# Altium project BEE-1012 PAY-EXP_V100.PrjPcb (part 2 of 4)

## Sheet 08_SAMA7G54-MPU.SchDoc
size 420 x 297 mm; SheetNumber: 13; SheetTotal: 33
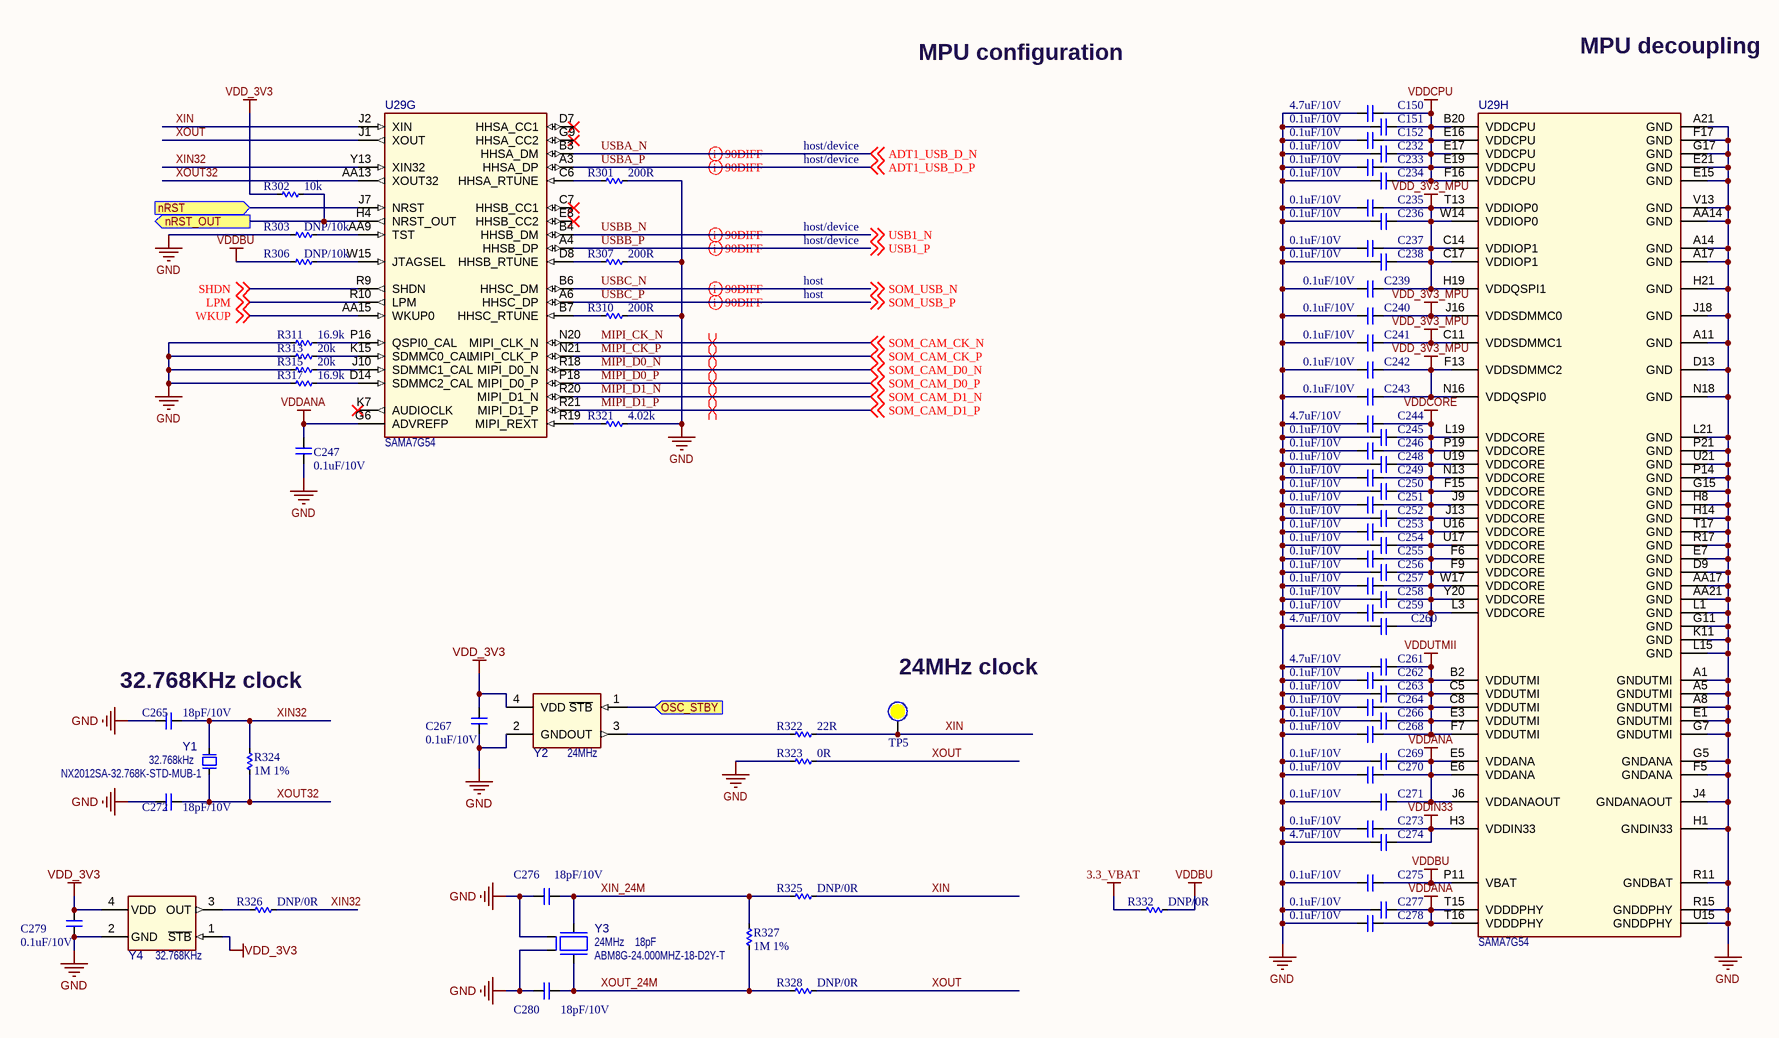
[diagram p14: 08_SAMA7G54-MPU.SchDoc]

### Parts
(Parts that share a designator on the sheet are numbered #1, #2 ... from top to bottom, then left to right.)
C150#2  4.7uF/10V  [CAP_C_1005X50_L]
C151#2  0.1uF/10V  [CAP_C_0603x30]
C152#2  0.1uF/10V  [CAP_C_0603x30]
C232  0.1uF/10V  [CAP_C_0603x30]
C233  0.1uF/10V  [CAP_C_0603x30]
C234  0.1uF/10V  [CAP_C_0603x30]
C235  0.1uF/10V  [CAP_C_0603x30]
C236  0.1uF/10V  [CAP_C_0603x30]
C237  0.1uF/10V  [CAP_C_0603x30]
C238  0.1uF/10V  [CAP_C_0603x30]
C239  0.1uF/10V  [CAP_C_0603x30]
C240  0.1uF/10V  [CAP_C_0603x30]
C241  0.1uF/10V  [CAP_C_0603x30]
C242  0.1uF/10V  [CAP_C_0603x30]
C243  0.1uF/10V  [CAP_C_0603x30]
C244  4.7uF/10V  [CAP_C_1005X50_L]
C245  0.1uF/10V  [CAP_C_0603x30]
C246  0.1uF/10V  [CAP_C_0603x30]
C247  0.1uF/10V  [CAP_C_0603x30]
C248  0.1uF/10V  [CAP_C_0603x30]
C249  0.1uF/10V  [CAP_C_0603x30]
C250  0.1uF/10V  [CAP_C_0603x30]
C251  0.1uF/10V  [CAP_C_0603x30]
C252  0.1uF/10V  [CAP_C_0603x30]
C253  0.1uF/10V  [CAP_C_0603x30]
C254  0.1uF/10V  [CAP_C_0603x30]
C255  0.1uF/10V  [CAP_C_0603x30]
C256  0.1uF/10V  [CAP_C_0603x30]
C257  0.1uF/10V  [CAP_C_0603x30]
C258  0.1uF/10V  [CAP_C_0603x30]
C259  0.1uF/10V  [CAP_C_0603x30]
C260  4.7uF/10V  [CAP_C_1005X50_L]
C261  4.7uF/10V  [CAP_C_1005X50_L]
C262  0.1uF/10V  [CAP_C_0603x30]
C263  0.1uF/10V  [CAP_C_0603x30]
C264  0.1uF/10V  [CAP_C_0603x30]
C265  18pF/10V  [CAP_C_0603x30]
C266  0.1uF/10V  [CAP_C_0603x30]
C267  0.1uF/10V  [CAP_C_0603x30]
C268  0.1uF/10V  [CAP_C_0603x30]
C269  0.1uF/10V  [CAP_C_0603x30]
C270  0.1uF/10V  [CAP_C_0603x30]
C271  0.1uF/10V  [CAP_C_0603x30]
C272  18pF/10V  [CAP_C_0603x30]
C273  0.1uF/10V  [CAP_C_0603x30]
C274  4.7uF/10V  [CAP_C_1005X50_L]
C275  0.1uF/10V  [CAP_C_0603x30]
C276  18pF/10V  [CAP_C_0603x30]
C277  0.1uF/10V  [CAP_C_0603x30]
C278  0.1uF/10V  [CAP_C_0603x30]
C279  0.1uF/10V  [CAP_C_0603x30]
C280  18pF/10V  [CAP_C_0603x30]
R301  200R  [RES_C_0603X30]
R302  10k  [RES_C_0603X30]
R303  DNP/10k  [RES_C_0603X30]
R306  DNP/10k  [RES_C_0603X30]
R307  200R  [RES_C_0603X30]
R310  200R  [RES_C_0603X30]
R311  16.9k  [RES_C_0603X30]
R313  20k  [RES_C_0603X30]
R315  20k  [RES_C_0603X30]
R317  16.9k  [RES_C_0603X30]
R321  4.02k  [RES_C_0603X30]
R322  22R  [RES_C_0603X30]
R323  0R  [RES_C_0603X30]
R324  1M 1%  [RES_C_1005x30_L]
R325  DNP/0R  [RES_C_0603X30]
R326  DNP/0R  [RES_C_0603X30]
R327  1M 1%  [RES_C_1005x30_L]
R328  DNP/0R  [RES_C_0603X30]
R332  DNP/0R  [RES_C_1005x30_L]
TP5  (no value)  [TP_1mm_SMD]  (no BOM)
U29  SAMA7G54  [TFBGA-343_14x14 - 2.5mm]  (parts G,H of 8)
Y1  value 32.768kHz  Manufacturer Part Number 1: NX2012SA-32.768K-STD-MUB-1  [CRYSTAL_NX2012SA]  (hidden comment: Crystal 2 Pins)
Y2  value 24MHz  [DFN-4_2.5x2]  (hidden comment: DSC10xx DFN-4)
Y3  value 24MHz  Load Capacitance: 18pF  Manufacturer Part Number 1: ABM8G-24.000MHZ-18-D2Y-T  [CRYSTAL_ABM8G]  (hidden comment: Crystal 4 Pins)
Y4  value 32.768KHz  [DFN-4_2x1.6]  (hidden comment: DSC60xx DFN-4_LGA-4)

### Ports
nRST (in), nRST_OUT (out), OSC_STBY (in)

### Nets
3.3_VBAT: R332.1
GND: C150#2.2 C151#2.2 C152#2.2 C232.2 C233.2 C234.2 C235.2 C236.2 C237.2 C238.2 C239.2 C240.2 C241.2 C242.2 C243.2 C244.2 C245.2 C246.2 C247.1 C248.2 C249.2 C250.2 C251.2 C252.2 C253.2 C254.2 C255.2 C256.2 C257.2 C258.2 C259.2 C260.2 C261.2 C262.2 C263.2 C264.2 C265.2 C266.2 C267.1 C268.2 C269.2 C270.2 C271.2 C272.2 C273.2 C274.2 C275.2 C276.2 C277.2 C278.2 C279.1 C280.2 R301.1 R303.2 R307.1 R310.1 R311.2 R313.2 R315.2 R317.2 R321.1 R323.1 U29.A1(GNDUTMI) U29.A5(GNDUTMI) U29.A8(GNDUTMI) U29.A11(GND) U29.A14(GND) U29.A17(GND) U29.A21(GND) U29.AA14(GND) U29.AA17(GND) U29.AA21(GND) U29.D9(GND) U29.D13(GND) U29.E1(GNDUTMI) U29.E7(GND) U29.E15(GND) U29.E21(GND) U29.F5(GNDANA) U29.F17(GND) U29.G5(GNDANA) U29.G7(GNDUTMI) U29.G11(GND) U29.G15(GND) U29.G17(GND) U29.H1(GNDIN33) U29.H8(GND) U29.H14(GND) U29.H21(GND) U29.J4(GNDANAOUT) U29.J18(GND) U29.K11(GND) U29.L1(GND) U29.L15(GND) U29.L21(GND) U29.N18(GND) U29.P14(GND) U29.P21(GND) U29.R11(GNDBAT) U29.R15(GNDDPHY) U29.R17(GND) U29.T17(GND) U29.U15(GNDDPHY) U29.U21(GND) U29.V13(GND) Y2.2(GND) Y3.2(GND) Y3.4(GND) Y4.2(GND)
VDD_3V3: C267.2 C279.2 R302.2 Y2.4(VDD) Y4.1(~{STB}) Y4.4(VDD)
VDD_3V3_MPU: C235.1 C236.1 C237.1 C238.1 C239.1 C240.1 C241.1 C242.1 C243.1 U29.C11(VDDSDMMC1) U29.C14(VDDIOP1) U29.C17(VDDIOP1) U29.F13(VDDSDMMC2) U29.H19(VDDQSPI1) U29.J16(VDDSDMMC0) U29.N16(VDDQSPI0) U29.T13(VDDIOP0) U29.W14(VDDIOP0)
VDDANA: C247.2 C269.1 C270.1 C271.1 C277.1 C278.1 U29.E5(VDDANA) U29.E6(VDDANA) U29.G6(ADVREFP) U29.J6(VDDANAOUT) U29.T15(VDDDPHY) U29.T16(VDDDPHY)
VDDBU: C275.1 R306.2 R332.2 U29.P11(VBAT)
VDDCORE: C244.1 C245.1 C246.1 C248.1 C249.1 C250.1 C251.1 C252.1 C253.1 C254.1 C255.1 C256.1 C257.1 C258.1 C259.1 C260.1 U29.F6(VDDCORE) U29.F9(VDDCORE) U29.F15(VDDCORE) U29.J9(VDDCORE) U29.J13(VDDCORE) U29.L3(VDDCORE) U29.L19(VDDCORE) U29.N13(VDDCORE) U29.P19(VDDCORE) U29.U16(VDDCORE) U29.U17(VDDCORE) U29.U19(VDDCORE) U29.W17(VDDCORE) U29.Y20(VDDCORE)
VDDCPU: C150#2.1 C151#2.1 C152#2.1 C232.1 C233.1 C234.1 U29.B20(VDDCPU) U29.E16(VDDCPU) U29.E17(VDDCPU) U29.E19(VDDCPU) U29.F16(VDDCPU)
VDDIN33: C273.1 C274.1 U29.H3(VDDIN33)
VDDUTMII: C261.1 C262.1 C263.1 C264.1 C266.1 C268.1 U29.B2(VDDUTMI) U29.C5(VDDUTMI) U29.C8(VDDUTMI) U29.E3(VDDUTMI) U29.F7(VDDUTMI)
ADT1_USB_D_N: U29.B3(HHSA_DM) ; off-sheet ADT1_USB_D_N  [also labelled USBA_N]  [project net IF_SOM_USB_N]
ADT1_USB_D_P: U29.A3(HHSA_DP) ; off-sheet ADT1_USB_D_P  [also labelled USBA_P]  [project net IF_SOM_USB_P]
LPM: U29.R10(LPM) ; off-sheet LPM
MIPI_CK_N: U29.N20(MIPI_CLK_N) ; off-sheet SOM_CAM_CK_N  [also labelled SOM_CAM_CK_N]
MIPI_CK_P: U29.N21(MIPI_CLK_P) ; off-sheet SOM_CAM_CK_P  [also labelled SOM_CAM_CK_P]
MIPI_D0_N: U29.R18(MIPI_D0_N) ; off-sheet SOM_CAM_D0_N  [also labelled SOM_CAM_D0_N]
MIPI_D0_P: U29.P18(MIPI_D0_P) ; off-sheet SOM_CAM_D0_P  [also labelled SOM_CAM_D0_P]
MIPI_D1_N: U29.R20(MIPI_D1_N) ; off-sheet SOM_CAM_D1_N  [also labelled SOM_CAM_D1_N]
MIPI_D1_P: U29.R21(MIPI_D1_P) ; off-sheet SOM_CAM_D1_P  [also labelled SOM_CAM_D1_P]
SHDN: U29.R9(SHDN) ; off-sheet SHDN
USBB_N: U29.B4(HHSB_DM) ; off-sheet USB1_N  [also labelled USB1_N]
USBB_P: U29.A4(HHSB_DP) ; off-sheet USB1_P  [also labelled USB1_P]
USBC_N: U29.B6(HHSC_DM) ; off-sheet SOM_USB_N  [also labelled SOM_USB_N]
USBC_P: U29.A6(HHSC_DP) ; off-sheet SOM_USB_P  [also labelled SOM_USB_P]
WKUP: U29.AA15(WKUP0) ; off-sheet WKUP
XIN: R322.2 R325.2 TP5.0 U29.J2(XIN)
XIN32: C265.1 R324.1 R326.2 U29.Y13(XIN32) Y1.2(Osc2)
XIN_24M: C276.1 R325.1 R327.2 Y3.3(Osc2)
XOUT: R323.2 R328.2 U29.J1(XOUT)
XOUT32: C272.1 R324.2 U29.AA13(XOUT32) Y1.1(Osc1)
XOUT_24M: C280.1 R327.1 R328.1 Y3.1(Osc1)
NetC300_2: U29.J7(NRST) ; port nRST
NetQ27_3: Y2.1(~{STB}) ; port OSC_STBY
NetR301_2: R301.2 U29.C6(HHSA_RTUNE)
NetR302_1: R302.1 U29.H4(NRST_OUT) ; port nRST_OUT
NetR303_1: R303.1 U29.AA9(TST)
NetR306_1: R306.1 U29.W15(JTAGSEL)
NetR307_2: R307.2 U29.D8(HHSB_RTUNE)
NetR310_2: R310.2 U29.B7(HHSC_RTUNE)
NetR311_1: R311.1 U29.P16(QSPI0_CAL)
NetR313_1: R313.1 U29.K15(SDMMC0_CAL)
NetR315_1: R315.1 U29.J10(SDMMC1_CAL)
NetR317_1: R317.1 U29.D14(SDMMC2_CAL)
NetR321_2: R321.2 U29.R19(MIPI_REXT)
NetR322_1: R322.1 Y2.3(OUT)
NetR326_1: R326.1 Y4.3(OUT)

Not connected (* = marked no-connect by the designer): U29 C7(HHSB_CC1)* D7(HHSA_CC1)* E8(HHSB_CC2)* G9(HHSA_CC2)* K7(AUDIOCLK)*

### Layout directives
differential pair; differential pair class DIFF90; net class DIFF90: IF_SOM_USB_N, IF_SOM_USB_P, USBB_N, USBB_P, USBC_N, USBC_P
differential pair; net class DIFF100; differential pair class DIFF100: MIPI_CK_N, MIPI_CK_P, MIPI_D0_N, MIPI_D0_P, MIPI_D1_N, MIPI_D1_P

### Notes on the sheet
- MPU configuration
- MPU decoupling
- host/device
- host
- (near C265) 32.768KHz clock
- (near TP5) 24MHz clock
- Project:
- BEE-1012
- Sub-system:
- SATELLITE_EXP_CONTROLLER
- Design by:
- SANG HUYNH
- BAO BUI
- Sheet title:
- Sheet
- A3
- of
- Checked by:
- Approved by:
- VU PHAM
- Revision:
- Document No:
- Size:
- Date:

### Library data of the parts
C150#2 C151#2 C152#2 C232-C280 = _CAP_C_2: CAP
R301-R303 R306 R307 R310 R311 R313 R315 R317 R321-R328 R332 = _RES_B_2: RES
TP5 = Test Point: Solder: NF
U29 = SAMA7G54: SAMA7G54 MPU 1000MHz Cortex-A7 TFBGA-343; Manufacturer Part Number 1: SAMA7G54-V/4HB; Manufacturer 1: Microchip; Description_: MCHP MPU 32-BIT Cortex-A7 1000MHz 128kB SAMA7G54-V/4HB TFBGA-343; Populated: YES; MCHP-ID: MIC8923; Symbol: SAMA7G54 TFBGA-343; Dev Tools Status: Design; Owner: Ciprian Abramov; Package: TFBGA-343; Value: SAMA7G54; Type: 32-Bit MPU; Status: MCL Design; Revision: 1; Category: MCHP-Microcontroller; ComponentLink1Description: SVN Datasheet; ComponentLink2Description: Local Datasheet; ComponentLink3URL: C:\ALTIUM_WORK\00001_MCHP-CDB\Library\LibraryRefs\SAMA7G54 TFBGA-343.SchLib; ComponentLink3Description: Open Symbol; ComponentLink4URL: C:\ALTIUM_WORK\00001_MCHP-CDB\Library\Footprints\TFBGA-343_14x14.PcbLib; ComponentLink4Description: Open Footprint; ComponentLink5Description: Open Footprint 2; ComponentLink6Description: Open Footprint 3; ComponentLink7Description: Open Footprint 4; Supplier 1: Microchip; Supplier Part Number 1: SAMA7G54-V/4HB; Quantity Override: 1
Y1 = OSC_32.768kHz: Crystal; Manufacturer 1: NDK; MCHP-ID: OSC1092; Description_: CRYSTAL 32.768kHz 12.5pF SMD NX2012SA; Dev Tools Status: Production; Owner: Jamus Griego; Tolerance: ±20ppm; Load Capacitance: 12.5pF; Populated: YES; Revision: 1; Symbol: Crystal 2 Pins; Status: MCL Design; ComponentLink1URL: https://chn-vm-apps.microchip.com/mchprepo/parts/Datasheets/c_NX2012SA-STD-MUB-1_e.pdf; ComponentLink1Description: SVN Datasheet; ComponentLink2URL: C:\ALTIUM_WORK\00001_MCHP-CDB\Datasheets\c_NX2012SA-STD-MUB-1_e.pdf; ComponentLink2Description: Local Datasheet; ComponentLink3URL: C:\ALTIUM_WORK\00001_MCHP-CDB\Library\LibraryRefs\Crystal 2 Pins.SchLib; ComponentLink3Description: Open Symbol; ComponentLink4URL: C:\ALTIUM_WORK\00001_MCHP-CDB\Library\Footprints\CRYSTAL_NX2012SA.PcbLib; ComponentLink4Description: Open Footprint; ComponentLink5Description: Open Footprint 2; ComponentLink6Description: Open Footprint 3; ComponentLink7Description: Open Footprint 4; Type: Crystal; Category: Crystal/Oscillator; Supplier 1: Digi-Key; Supplier Part Number 1: 644-1219-1-ND; Quantity Override: 1
Y2 = MIC6659: Manufacturer 1: Microchip Technology; Manufacturer Part Number 1: DSC1001DI5-024.0000T; Description_: MCHP CLOCK OSCILLATOR SINGLE 24MHz DSC1001DI5-024.0000 SMD-2520; Dev Tools Status: Design; Owner: Maurizio Gavardoni; Populated: YES; MCHP-ID: MIC6659; Revision: A; Symbol: DSC10xx DFN-4; Status: MCL Design; ComponentLink1Description: SVN Datasheet; ComponentLink2Description: Local Datasheet; ComponentLink3URL: C:\ALTIUM_WORK\00001_MCHP-CDB\Library\LibraryRefs\DSC10xx DFN-4.SchLib; ComponentLink3Description: Open Symbol; ComponentLink4URL: C:\ALTIUM_WORK\00001_MCHP-CDB\Library\Footprints\DFN-4_2.5x2.PcbLib; ComponentLink4Description: Open Footprint; ComponentLink5Description: Open Footprint 2; ComponentLink6Description: Open Footprint 3; ComponentLink7Description: Open Footprint 4; Category: MCHP-Clock/Timing; Type: Oscillator; Supplier 1: Digi-Key; Supplier Part Number 1: DSC1001DI5-024.0000T-ND; Quantity Override: 1
Y3 = OSC_24MHz: Crystal; Manufacturer 1: Abracon Corporation; MCHP-ID: OSC1047; Description_: CRYSTAL 24MHz 18pF SMD ABM8G; Dev Tools Status: Production; Owner: Mark Loper; Populated: DNP; Revision: 1; Symbol: Crystal 4 Pins; Status: MCL Design; ComponentLink1URL: https://chn-vm-apps.microchip.com/mchprepo/parts/Datasheets/ABM8G.pdf; ComponentLink1Description: SVN Datasheet; ComponentLink2URL: C:\ALTIUM_WORK\00001_MCHP-CDB\Datasheets\ABM8G.pdf; ComponentLink2Description: Local Datasheet; ComponentLink3URL: C:\ALTIUM_WORK\00001_MCHP-CDB\Library\LibraryRefs\Crystal 4 Pins.SchLib; ComponentLink3Description: Open Symbol; ComponentLink4URL: C:\ALTIUM_WORK\00001_MCHP-CDB\Library\Footprints\CRYSTAL_ABM8G.PcbLib; ComponentLink4Description: Open Footprint; ComponentLink5Description: Open Footprint 2; ComponentLink6Description: Open Footprint 3; ComponentLink7Description: Open Footprint 4; Package: ABM8G; Type: Crystal; Category: Crystal/Oscillator; Supplier 1: Digi-Key; Supplier Part Number 1: 535-10273-1-ND; Quantity Override: 1
Y4 = MIC8888: Manufacturer 1: Microchip Technology; Manufacturer Part Number 1: DSC6003MA3B-032K768; Description_: MCHP CLOCK OSCILLATOR SINGLE 32.768KHz DSC6003MA3B-032K768 SMD DFN-4; Dev Tools Status: Design; Owner: Ciprian Abramov; Populated: DNP; MCHP-ID: MIC8888; Revision: 1; Symbol: DSC60xx DFN-4_LGA-4; Status: MCL Design; ComponentLink1Description: SVN Datasheet; ComponentLink2Description: Local Datasheet; ComponentLink3URL: C:\ALTIUM_WORK\00001_MCHP-CDB\Library\LibraryRefs\DSC60xx DFN-4_LGA-4.SchLib; ComponentLink3Description: Open Symbol; ComponentLink4URL: C:\ALTIUM_WORK\00001_MCHP-CDB\Library\Footprints\DFN-4_2x1.6.PcbLib; ComponentLink4Description: Open Footprint; ComponentLink5Description: Open Footprint 2; ComponentLink6Description: Open Footprint 3; ComponentLink7Description: Open Footprint 4; Category: MCHP-Clock/Timing; Type: Oscillator; Supplier 1: Digi-Key; Supplier Part Number 1: DSC6003MA3B-032K768-ND; Quantity Override: 1; Supplier 2: Mouser; Supplier Part Number 2: 579-6003MA3B032K768

## Sheet 08_SAMA7G54-PMIC.SchDoc
size 420 x 297 mm; SheetNumber: 14; SheetTotal: 33
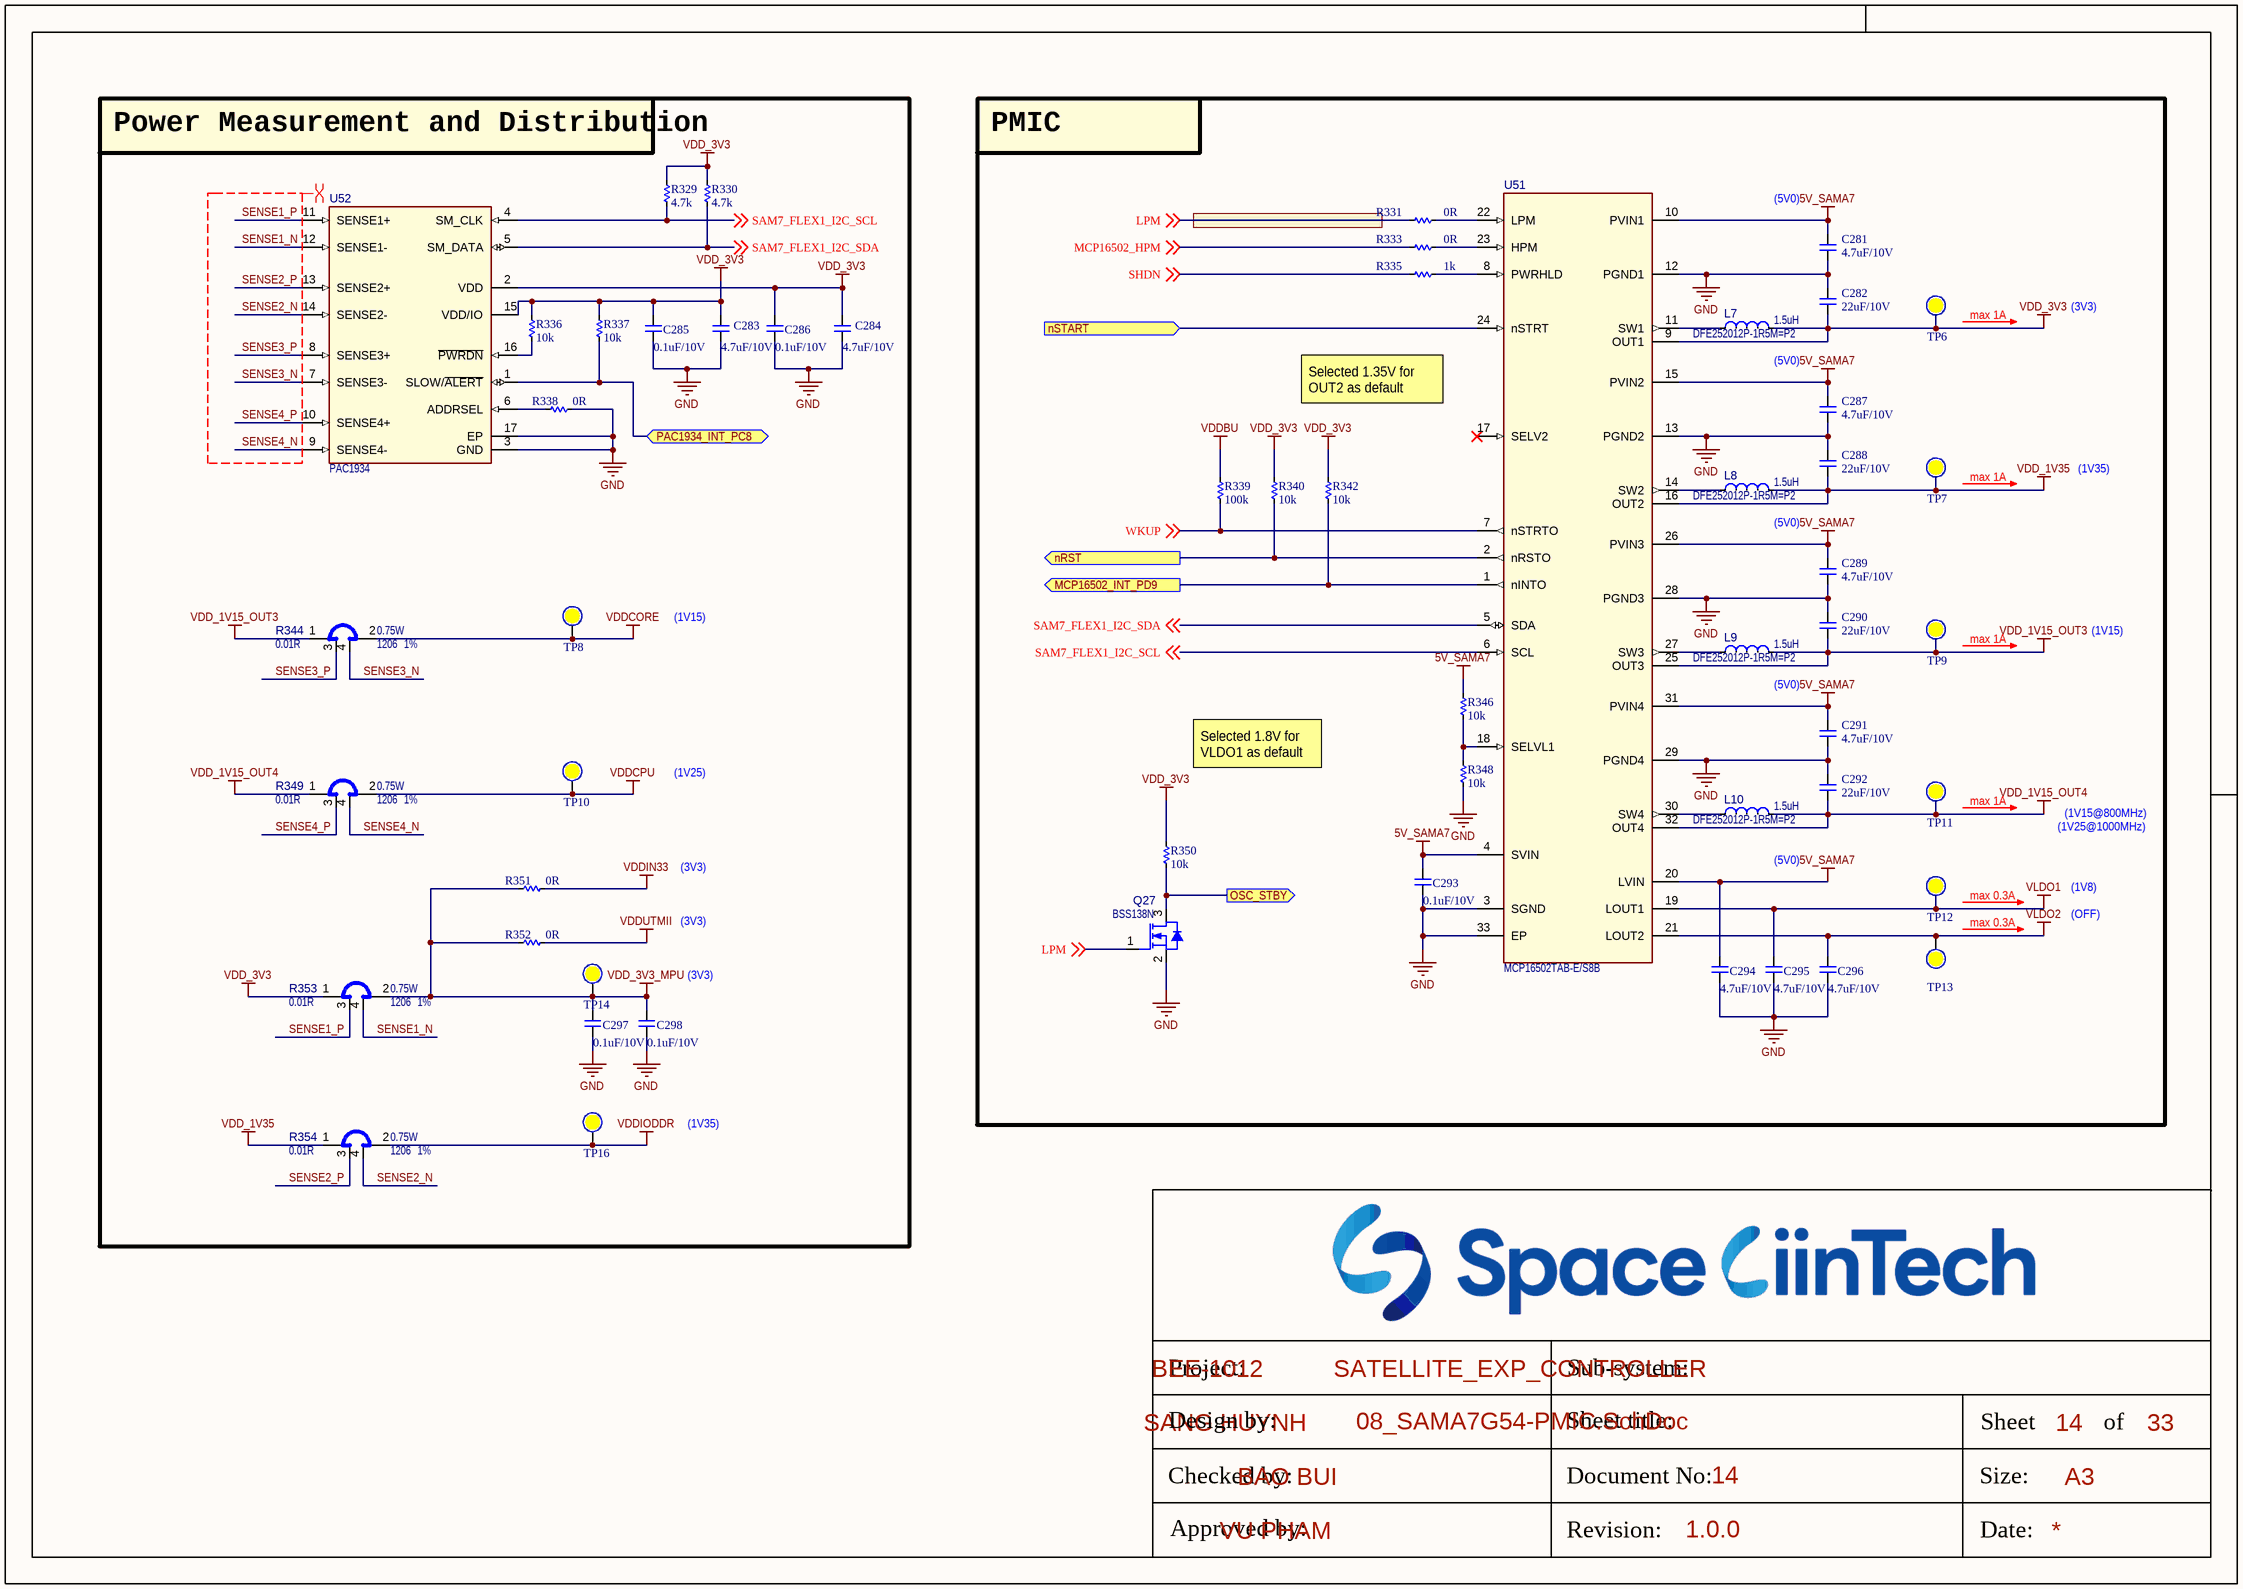
[diagram p15: 08_SAMA7G54-PMIC.SchDoc]

### Parts
C281  4.7uF/10V  [CAP_C_1005X50_L]
C282  22uF/10V  [CAP_C_1608X80]
C283  4.7uF/10V  [CAP_C_1005X50_L]
C284  4.7uF/10V  [CAP_C_1005X50_L]
C285  0.1uF/10V  [CAP_C_1005X50_L]
C286  0.1uF/10V  [CAP_C_0603x30]
C287  4.7uF/10V  [CAP_C_1005X50_L]
C288  22uF/10V  [CAP_C_1608X80]
C289  4.7uF/10V  [CAP_C_1005X50_L]
C290  22uF/10V  [CAP_C_1608X80]
C291  4.7uF/10V  [CAP_C_1005X50_L]
C292  22uF/10V  [CAP_C_1608X80]
C293  0.1uF/10V  [CAP_C_0603x30]
C294  4.7uF/10V  [CAP_C_1005X50_L]
C295  4.7uF/10V  [CAP_C_1005X50_L]
C296  4.7uF/10V  [CAP_C_1005X50_L]
C297  0.1uF/10V  [CAP_C_0603x30]
C298  0.1uF/10V  [CAP_C_0603x30]
L7  value 1.5uH  [IND_C_1008]  (hidden comment: DFE252012P-1R5M=P2)
L8  value 1.5uH  [IND_C_1008]  (hidden comment: DFE252012P-1R5M=P2)
L9  value 1.5uH  [IND_C_1008]  (hidden comment: DFE252012P-1R5M=P2)
L10  value 1.5uH  [IND_C_1008]  (hidden comment: DFE252012P-1R5M=P2)
Q27  value BSS138N  [SOT-23-3]  (hidden comment: BSS138NH6327XTSA2)
R329  4.7k  [RES_C_1005x30_L]
R330  4.7k  [RES_C_1005x30_L]
R331  0R  [RES_C_0603X30]
R333  0R  [RES_C_0603X30]
R335  1k  [RES_C_0603X30]
R336  10k  [RES_C_1005x30_L]
R337  10k  [RES_C_1005x30_L]
R338  0R  [RES_C_0603X30]
R339  100k  [RES_C_0603X30]
R340  10k  [RES_C_0603X30]
R342  10k  [RES_C_0603X30]
R344  value 0.01R  Package: 1206  Tolerance: 1%  Power: 0.75W  [RES_C_1206_SHUNT]  (hidden comment: KRL1632E-M-R010-F-T5)
R346  10k  [RES_C_0603X30]
R348  10k  [RES_C_0603X30]
R349  value 0.01R  Package: 1206  Tolerance: 1%  Power: 0.75W  [RES_C_1206_SHUNT]  (hidden comment: KRL1632E-M-R010-F-T5)
R350  10k  [RES_C_0603X30]
R351  0R  [RES_C_1608X60_L]
R352  0R  [RES_C_1608X60_L]
R353  value 0.01R  Package: 1206  Tolerance: 1%  Power: 0.75W  [RES_C_1206_SHUNT]  (hidden comment: KRL1632E-M-R010-F-T5)
R354  value 0.01R  Package: 1206  Tolerance: 1%  Power: 0.75W  [RES_C_1206_SHUNT]  (hidden comment: KRL1632E-M-R010-F-T5)
TP6  (no value)  [Testpoint_50]  (no BOM)
TP7  (no value)  [Testpoint_50]  (no BOM)
TP8  (no value)  [Testpoint_50]  (no BOM)
TP9  (no value)  [Testpoint_50]  (no BOM)
TP10  (no value)  [Testpoint_50]  (no BOM)
TP11  (no value)  [Testpoint_50]  (no BOM)
TP12  (no value)  [Testpoint_50]  (no BOM)
TP13  (no value)  [Testpoint_50]  (no BOM)
TP14  (no value)  [Testpoint_50]  (no BOM)
TP16  (no value)  [Testpoint_50]  (no BOM)
U51  value MCP16502TAB-E/S8B  [QFN-32_5X5_EP3.7X3.7]  (hidden comment: MCP16502 QFN-32)
U52  value PAC1934  [UQFN-16_4X4_EP2.6X2.6]  (hidden comment: PAC1934 UQFN-16)

### Blocks framed on the sheet
Power Measurement and Distribution: C283-C286 C297 C298 R329 R330 R336-R338 R344 R349 R351-R354 TP8 TP10 TP14 TP16 U52
PMIC: C281 C282 C287-C296 L7-L10 Q27 R331 R333 R335 R339 R340 R342 R346 R348 R350 TP6 TP7 TP9 TP11-TP13 U51

### Ports
MCP16502_INT_PD9 (out), nRST (out), nSTART (in), OSC_STBY (out), PAC1934_INT_PC8 (bidir)

### Nets
5V_SAMA7: C281.1 C287.1 C289.1 C291.1 C293.1 C294.1 R346.1 U51.4(SVIN) U51.10(PVIN1) U51.15(PVIN2) U51.20(LVIN) U51.26(PVIN3) U51.31(PVIN4)
GND: C281.2 C282.1 C283.2 C284.2 C285.2 C286.2 C287.2 C288.1 C289.2 C290.1 C291.2 C292.1 C293.2 C294.2 C295.2 C296.2 C297.2 C298.2 Q27.2(S) R338.2 R348.2 U51.3(SGND) U51.12(PGND1) U51.13(PGND2) U51.28(PGND3) U51.29(PGND4) U51.33(EP) U52.3(GND) U52.17(EP)
VDD_1V15_OUT3: C290.2 L9.2(F) R344.1 TP9.0 U51.25(OUT3)
VDD_1V15_OUT4: C292.2 L10.2(F) R349.1 TP11.0 U51.32(OUT4)
VDD_1V35: C288.2 L8.2(F) R354.1 TP7.0 U51.16(OUT2)
VDD_3V3: C282.2 C283.1 C284.1 C285.1 C286.1 L7.2(F) R329.1 R330.1 R336.1 R337.1 R340.2 R342.2 R350.1 R353.1 TP6.0 U51.9(OUT1) U52.2(VDD) U52.15(VDD/IO)
VDD_3V3_MPU: C297.1 C298.1 R351.1 R352.1 R353.2 TP14.0
VDDBU: R339.2
VDDCORE: R344.2 TP8.0
VDDCPU: R349.2 TP10.0
VDDIN33: R351.2
VDDIODDR: R354.2 TP16.0
VDDUTMII: R352.2
VLDO1: C295.1 TP12.0 U51.19(LOUT1)
VLDO2: C296.1 TP13.0 U51.21(LOUT2)
LPM: Q27.1(G) R331.1 ; off-sheet LPM
MCP16502_HPM: R333.1 ; off-sheet MCP16502_HPM
SAM7_FLEX1_I2C_SCL: R329.2 U51.6(SCL) U52.4(SM_CLK) ; off-sheet SAM7_FLEX1_I2C_SCL
SAM7_FLEX1_I2C_SDA: R330.2 U51.5(SDA) U52.5(SM_DATA) ; off-sheet SAM7_FLEX1_I2C_SDA
SENSE1_N: R353.4 U52.12(SENSE1-)
SENSE1_P: R353.3 U52.11(SENSE1+)
SENSE2_N: R354.4 U52.14(SENSE2-)
SENSE2_P: R354.3 U52.13(SENSE2+)
SENSE3_N: R344.4 U52.7(SENSE3-)
SENSE3_P: R344.3 U52.8(SENSE3+)
SENSE4_N: R349.4 U52.9(SENSE4-)
SENSE4_P: R349.3 U52.10(SENSE4+)
SHDN: R335.1 ; off-sheet SHDN
WKUP: R339.1 U51.7(nSTRTO) ; off-sheet WKUP
NetC300_2: R340.1 U51.2(nRSTO) ; port nRST
NetL7_1: L7.1(S) U51.11(SW1)
NetL8_1: L8.1(S) U51.14(SW2)
NetL9_1: L9.1(S) U51.27(SW3)
NetL10_1: L10.1(S) U51.30(SW4)
NetQ27_3: Q27.3(D) R350.2 ; port OSC_STBY
NetR286_2: U51.24(nSTRT) ; port nSTART
NetR331_2: R331.2 U51.22(LPM)
NetR333_2: R333.2 U51.23(HPM)
NetR335_2: R335.2 U51.8(PWRHLD)
NetR336_2: R336.2 U52.16(~{PWRDN})
NetR337_2: R337.2 U52.1(SLOW/~{ALERT}) ; port PAC1934_INT_PC8
NetR338_1: R338.1 U52.6(ADDRSEL)
NetR342_1: R342.1 U51.1(nINTO) ; port MCP16502_INT_PD9
NetR346_2: R346.2 R348.1 U51.18(SELVL1)

Not connected (* = marked no-connect by the designer): U51 17(SELV2)*

### Layout directives
differential pair: SENSE1_N, SENSE1_P, SENSE2_N, SENSE2_P, SENSE3_N, SENSE3_P, SENSE4_N, SENSE4_P

### Notes on the sheet
- (near C281) (5V0)
- (near TP6) max 1A
- (3V3)
- Selected 1.35V for OUT2 as default
- (5V0)
- (near TP7) max 1A
- (1V35)
- (1V15)
- (near TP9) max 1A
- (1V25)
- Selected 1.8V for VLDO1 as default
- (near TP11) max 1A
- (near L10) (5V0)
- (1V25@1000MHz)
- (1V15@800MHz)
- (near TP12) max 0.3A
- max 0.3A
- (1V8)
- (OFF)
- Project:
- BEE-1012
- Sub-system:
- SATELLITE_EXP_CONTROLLER
- Design by:
- SANG HUYNH
- BAO BUI
- Sheet title:
- Sheet
- A3
- of
- Checked by:
- Approved by:
- VU PHAM
- Revision:
- Document No:
- Size:
- Date:

### Library data of the parts
C281-C298 = _CAP_C_2: CAP
L7-L10 = IND1335: Inductor; Manufacturer 1: Murata Electronics North America; Description_: INDUCTOR 1.5uH 3.5A 20% SMD 1008; Dev Tools Status: Design; Owner: Razvan Cristescu; DCR: 0.06R; RMS Current: 3.5A; Test Frequency: 1MHz; Populated: YES; MCHP-ID: IND1335; Revision: A; Symbol: Inductor; Status: MCL Design; ComponentLink1URL: https://chn-vm-apps.microchip.com/mchprepo/parts/Datasheets/m_dfe252012p.pdf; ComponentLink1Description: SVN Datasheet; ComponentLink2URL: C:\ALTIUM_WORK\00001_MCHP-CDB\Datasheets\m_dfe252012p.pdf; ComponentLink2Description: Local Datasheet; ComponentLink3URL: C:\ALTIUM_WORK\00001_MCHP-CDB\Library\LibraryRefs\Inductor.SchLib; ComponentLink3Description: Open Symbol; ComponentLink4URL: C:\ALTIUM_WORK\00001_MCHP-CDB\Library\Footprints\IND_C_1008.PcbLib; ComponentLink4Description: Open Footprint; ComponentLink5Description: Open Footprint 2; ComponentLink6Description: Open Footprint 3; ComponentLink7Description: Open Footprint 4; Package: 1008; Type: Inductor; Category: Inductor; Manufacturer Part Number 1: DFE252012P-1R5M=P2; Supplier 1: Digi-Key; Supplier Part Number 1: 490-10648-6-ND; Quantity Override: 1
Q27 = TRA1223: Transistor MOS; Manufacturer 1: Infineon Technologies; Description_: TRANS FET N-CH BSS138N 60V 230mA SOT23-3; Dev Tools Status: Production; Type: FET; Current: 230mA; Drain to Source Voltage: 60V; Gate to Source Voltage: 20V; Power: 0.36W; Owner: Dragos Danaila; Populated: YES; MCHP-ID: TRA1223; Revision: 1; Symbol: Transistor MOS-N GSD; Status: MCL Design; Package: SOT23-3; ComponentLink1URL: https://chn-vm-apps.microchip.com/mchprepo/parts/Datasheets/Infineon-BSS138N-DS-v02_86-en.pdf; ComponentLink1Description: SVN Datasheet; ComponentLink2URL: C:\ALTIUM_WORK\00001_MCHP-CDB\Datasheets\Infineon-BSS138N-DS-v02_86-en.pdf; ComponentLink2Description: Local Datasheet; ComponentLink3URL: C:\ALTIUM_WORK\00001_MCHP-CDB\Library\LibraryRefs\Transistor MOS-N GSD.SchLib; ComponentLink3Description: Open Symbol; ComponentLink4URL: C:\ALTIUM_WORK\00001_MCHP-CDB\Library\Footprints\SOT-23-3.PcbLib; ComponentLink4Description: Open Footprint; ComponentLink5Description: Open Footprint 2; ComponentLink6Description: Open Footprint 3; ComponentLink7Description: Open Footprint 4; Operating Temperature: -55C to +150C; Category: Transistor; Voltage: 60V; Manufacturer Part Number 1: BSS138NH6327XTSA2; Supplier 1: Digi-Key; Supplier Part Number 1: BSS138NH6327XTSA2CT-ND; Quantity Override: 1
R329-R331 R333 R335-R340 R342 R346 R348 R350-R352 = _RES_B_2: RES
R344 R349 R353 R354 = RSMT1316: Shunt; Manufacturer 1: SUSUMU; Description_: RES SHUNT MF 0.01R 1% 0.75W SMD 1206; Dev Tools Status: Design; Temperature Coeffcient: 50ppm/C; Current: 8A; Owner: Ciprian Abramov; Populated: YES; MCHP-ID: RSMT1316; Revision: 1; Symbol: Shunt 4 Pin; Status: MCL Design; ComponentLink1URL: https://chn-vm-apps.microchip.com/mchprepo/parts/Datasheets/n_catalog_partition09_en.pdf; ComponentLink1Description: SVN Datasheet; ComponentLink2URL: C:\ALTIUM_WORK\00001_MCHP-CDB\Datasheets\n_catalog_partition09_en.pdf; ComponentLink2Description: Local Datasheet; ComponentLink3URL: C:\ALTIUM_WORK\00001_MCHP-CDB\Library\LibraryRefs\Shunt 4 Pin.SchLib; ComponentLink3Description: Open Symbol; ComponentLink4URL: C:\ALTIUM_WORK\00001_MCHP-CDB\Library\Footprints\RES_C_1206_SHUNT.PcbLib; ComponentLink4Description: Open Footprint; ComponentLink5Description: Open Footprint 2; ComponentLink6Description: Open Footprint 3; ComponentLink7Description: Open Footprint 4; Operating Temperature: -55C to +155C; Category: Resistor; Type: RES SMD; Composition: MF; Manufacturer Part Number 1: KRL1632E-M-R010-F-T5; Supplier 1: Digi-Key; Supplier Part Number 1: 408-1570-1-ND; Quantity Override: 1
TP6-TP14 TP16 = Test Point: Solder: NF
U51 = MIC8878: Manufacturer 1: Microchip Technology; Populated: YES; Description_: MCHP ANALOG PMIC SWITCHER Buck ADJ MCP16502TAB-E/S8B QFN-32 for SAMA7G5 MPU with LPDDR/DDR2/DDR3; Dev Tools Status: Design; Owner: Dragos Danaila; MCHP-ID: MIC8878; Symbol: MCP16502 QFN-32; Type: Switcher; Status: MCL Design; Revision: 1; Category: MCHP-Analog; ComponentLink1Description: SVN Datasheet; ComponentLink2Description: Local Datasheet; ComponentLink3URL: C:\ALTIUM_WORK\00001_MCHP-CDB\Library\LibraryRefs\MCP16502 QFN-32.SchLib; ComponentLink3Description: Open Symbol; ComponentLink4URL: C:\ALTIUM_WORK\00001_MCHP-CDB\Library\Footprints\QFN-32_5X5_EP3.7X3.7.PcbLib; ComponentLink4Description: Open Footprint; ComponentLink5Description: Open Footprint 2; ComponentLink6Description: Open Footprint 3; ComponentLink7Description: Open Footprint 4; Manufacturer Part Number 1: MCP16502TAB-E/S8B; Supplier 1: Digi-Key; Supplier Part Number 1: 150-MCP16502TAB-E/S8BCT-ND; Quantity Override: 1; ComponentLink2URL: C:\ALTIUM_WORK\00001_MCHP-CDB\Datasheets\MCP16502-High-Performance-PMIC-for-SAMA5DX-SAM9X6-MPUs-Data-Sheet-DS20006275B.pdf
U52 = MIC8883: Manufacturer 1: Microchip Technology; Manufacturer Part Number 1: PAC1934T-I/JQ; Description_: MCHP ANALOG POWER CURRENT SENSE MONITOR PAC1934T-I/JQ UQFN-16; Dev Tools Status: Design; Owner: Ciprian Abramov; Populated: YES; MCHP-ID: MIC8883; Symbol: PAC1934 UQFN-16; Type: Power/Current Sensor; Status: MCL Design; Revision: 1; Category: MCHP-Analog; ComponentLink1Description: SVN Datasheet; ComponentLink2Description: Local Datasheet; ComponentLink3URL: C:\ALTIUM_WORK\00001_MCHP-CDB\Library\LibraryRefs\PAC1934 UQFN-16.SchLib; ComponentLink3Description: Open Symbol; ComponentLink4URL: C:\ALTIUM_WORK\00001_MCHP-CDB\Library\Footprints\UQFN-16_4X4_EP2.6X2.6.PcbLib; ComponentLink4Description: Open Footprint; ComponentLink5Description: Open Footprint 2; ComponentLink6Description: Open Footprint 3; ComponentLink7Description: Open Footprint 4; Supplier 1: Digi-Key; Supplier Part Number 1: PAC1934T-I/JQCT-ND; Quantity Override: 1

## Sheet 08_SAMA7G54-PIO.SchDoc
size 420 x 297 mm; SheetNumber: 15; SheetTotal: 33
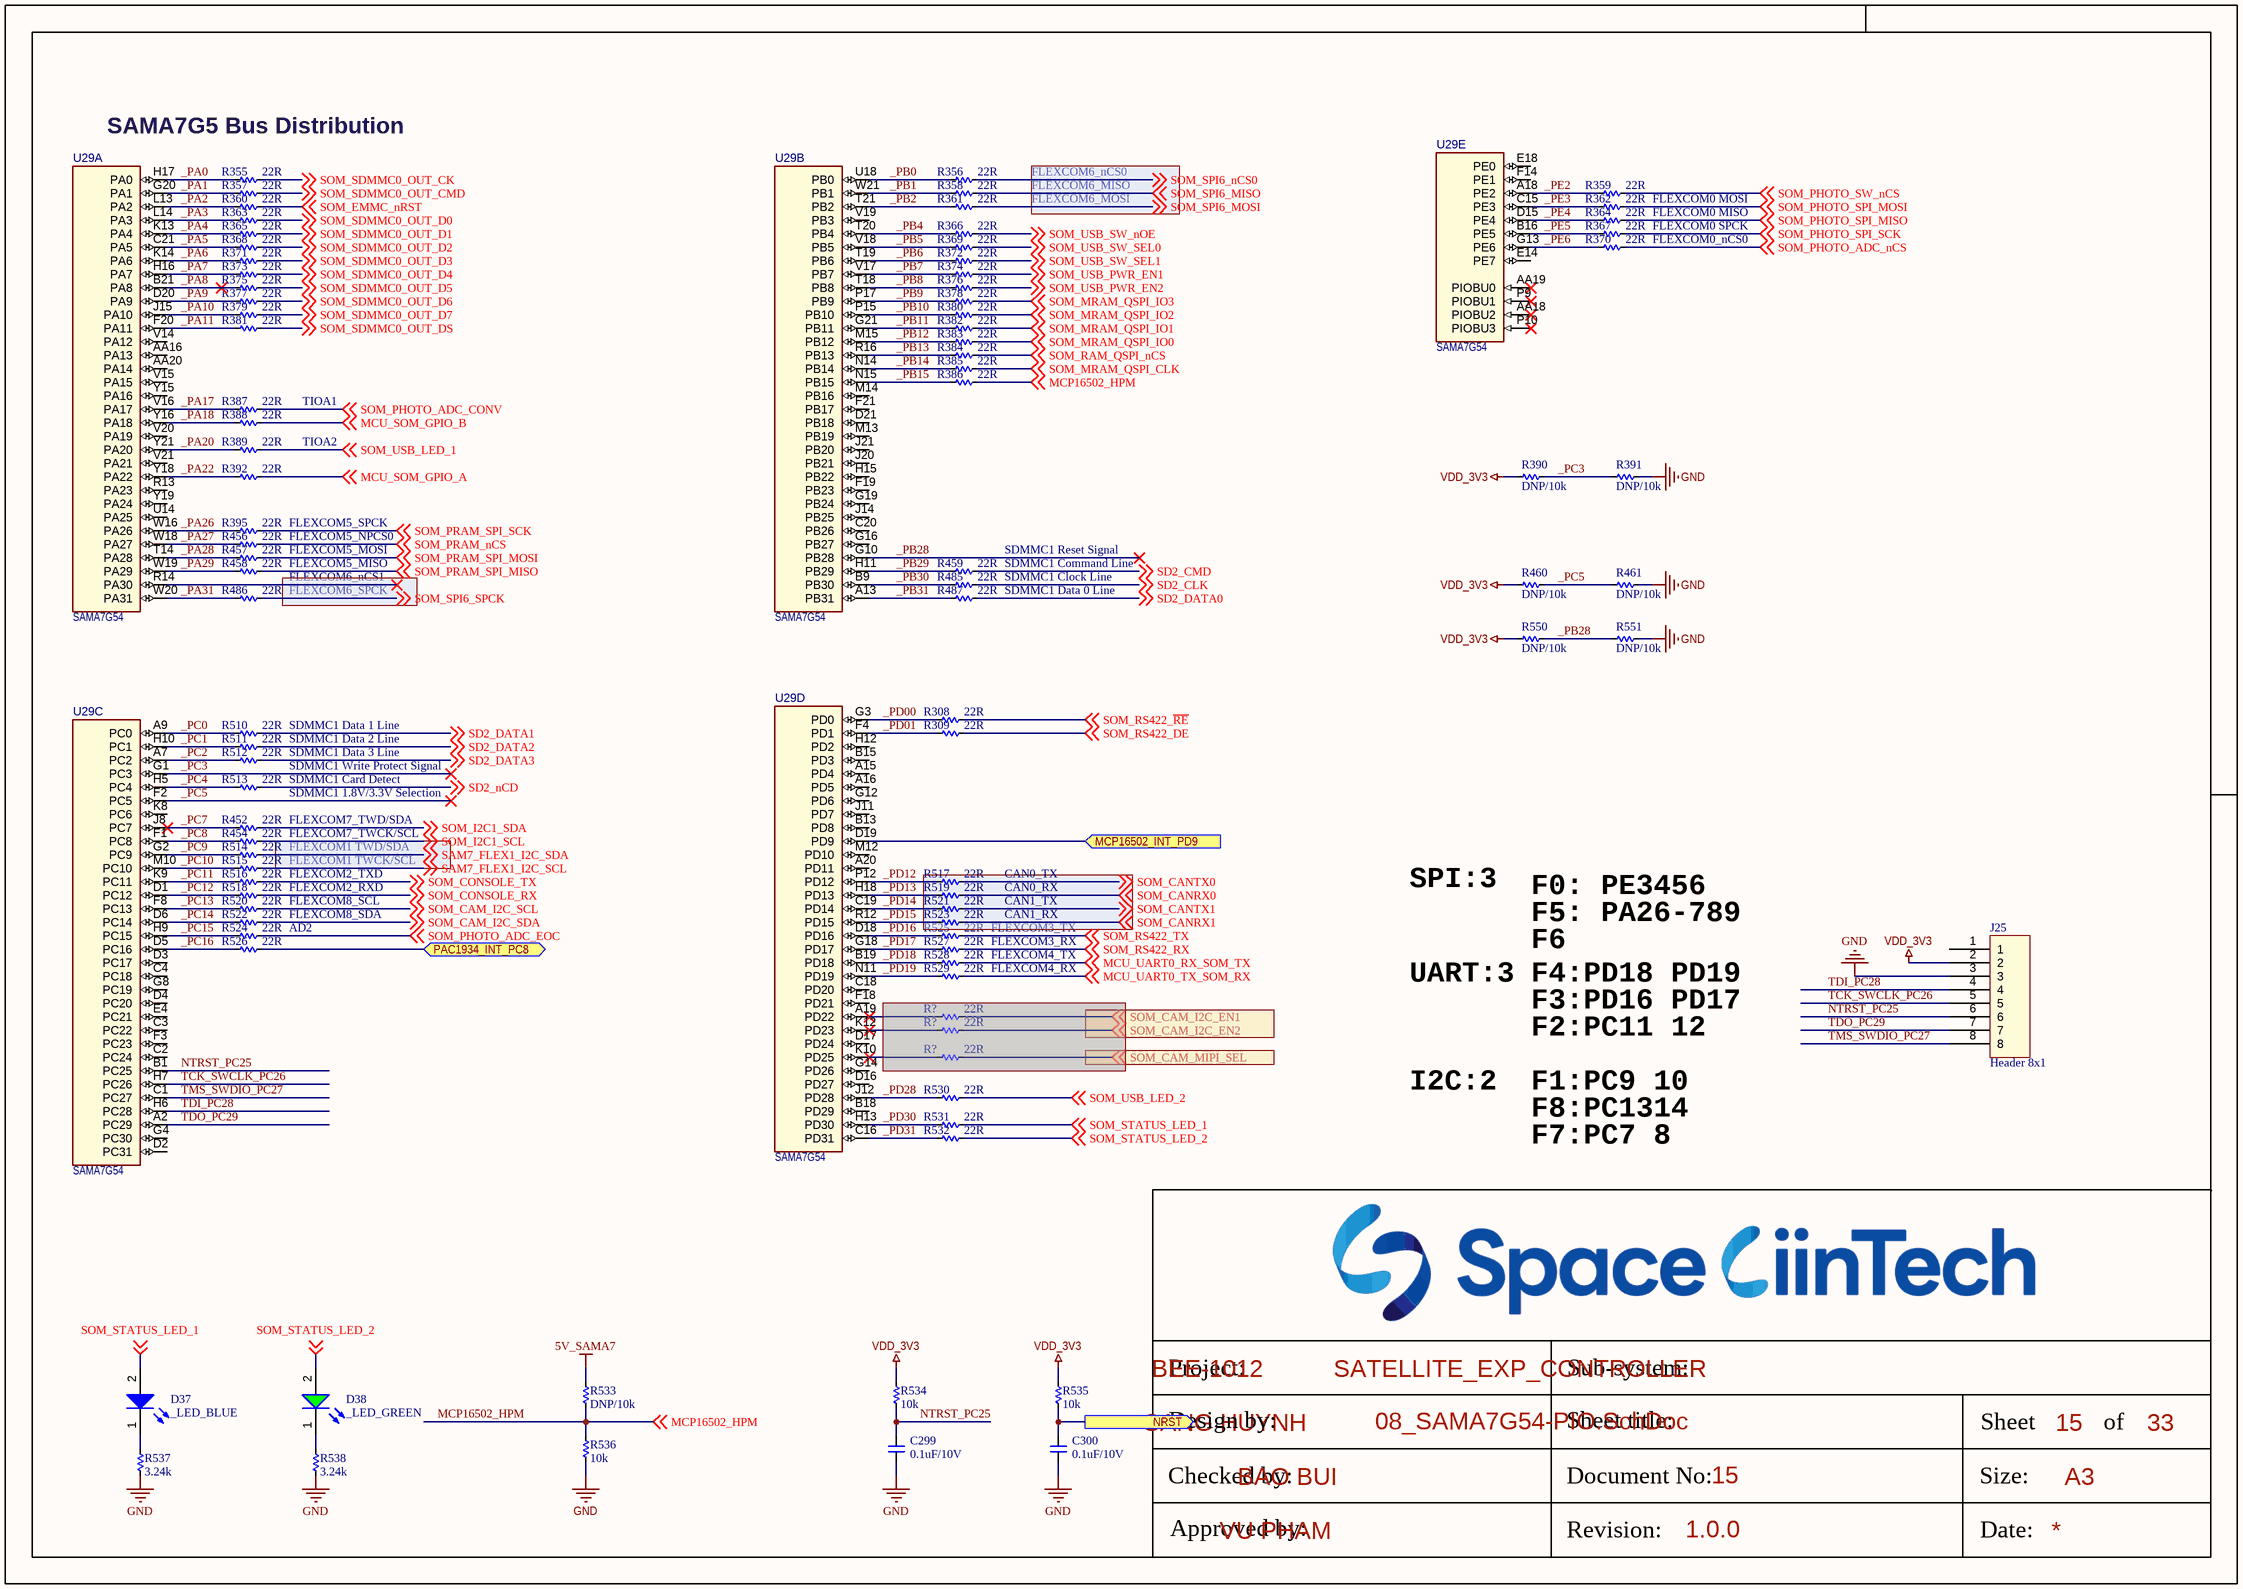
[diagram p16: 08_SAMA7G54-PIO.SchDoc]

### Parts
(Parts that share a designator on the sheet are numbered #1, #2 ... from top to bottom, then left to right.)
C299  0.1uF/10V  [CAP_C_0603x30]
C300  0.1uF/10V  [CAP_C_0603x30]
D37  _LED_BLUE  [LED_0402]
D38  _LED_GREEN  [LED_0402]
J25  Header 8x1  [SAMTEC_TSM-108-01-L-SV-P-TR]
R308  22R  [RES_C_0603X30]
R309  22R  [RES_C_0603X30]
R355  22R  [RES_C_0603X30]
R356  22R  [RES_C_0603X30]
R357  22R  [RES_C_0603X30]
R358  22R  [RES_C_0603X30]
R359  22R  [RES_C_0603X30]
R360  22R  [RES_C_0603X30]
R361  22R  [RES_C_0603X30]
R362  22R  [RES_C_0603X30]
R363  22R  [RES_C_0603X30]
R364  22R  [RES_C_0603X30]
R365  22R  [RES_C_0603X30]
R366  22R  [RES_C_0603X30]
R367  22R  [RES_C_0603X30]
R368  22R  [RES_C_0603X30]
R369  22R  [RES_C_0603X30]
R370  22R  [RES_C_0603X30]
R371  22R  [RES_C_0603X30]
R372  22R  [RES_C_0603X30]
R373  22R  [RES_C_0603X30]
R374  22R  [RES_C_0603X30]
R375  22R  [RES_C_0603X30]
R376  22R  [RES_C_0603X30]
R377  22R  [RES_C_0603X30]
R378  22R  [RES_C_0603X30]
R379  22R  [RES_C_0603X30]
R380  22R  [RES_C_0603X30]
R381  22R  [RES_C_0603X30]
R382  22R  [RES_C_0603X30]
R383  22R  [RES_C_0603X30]
R384  22R  [RES_C_0603X30]
R385  22R  [RES_C_0603X30]
R386  22R  [RES_C_0603X30]
R387  22R  [RES_C_0603X30]
R388  22R  [RES_C_0603X30]
R389  22R  [RES_C_0603X30]
R390  DNP/10k  [RES_C_0603X30]
R391  DNP/10k  [RES_C_0603X30]
R392  22R  [RES_C_0603X30]
R395  22R  [RES_C_0603X30]
R452  22R  [RES_C_0603X30]
R454  22R  [RES_C_0603X30]
R456  22R  [RES_C_0603X30]
R457  22R  [RES_C_0603X30]
R458  22R  [RES_C_0603X30]
R459  22R  [RES_C_0603X30]
R460  DNP/10k  [RES_C_0603X30]
R461  DNP/10k  [RES_C_0603X30]
R485  22R  [RES_C_0603X30]
R486  22R  [RES_C_0603X30]
R487  22R  [RES_C_0603X30]
R510  22R  [RES_C_0603X30]
R511  22R  [RES_C_0603X30]
R512  22R  [RES_C_0603X30]
R513  22R  [RES_C_0603X30]
R514  22R  [RES_C_0603X30]
R515  22R  [RES_C_0603X30]
R516  22R  [RES_C_0603X30]
R517  22R  [RES_C_0603X30]
R518  22R  [RES_C_0603X30]
R519  22R  [RES_C_0603X30]
R520  22R  [RES_C_0603X30]
R521  22R  [RES_C_0603X30]
R522  22R  [RES_C_0603X30]
R523  22R  [RES_C_0603X30]
R524  22R  [RES_C_0603X30]
R525  22R  [RES_C_0603X30]
R526  22R  [RES_C_0603X30]
R527  22R  [RES_C_0603X30]
R528  22R  [RES_C_0603X30]
R529  22R  [RES_C_0603X30]
R530  22R  [RES_C_0603X30]
R531  22R  [RES_C_0603X30]
R532  22R  [RES_C_0603X30]
R533  DNP/10k  [RES_C_0603X30]
R534  10k  [RES_C_0603X30]
R535  10k  [RES_C_0603X30]
R536  10k  [RES_C_0603X30]
R537  3.24k  [RES_C_1005x30_L]
R538  3.24k  [RES_C_1005x30_L]
R550  DNP/10k  [RES_C_0603X30]
R551  DNP/10k  [RES_C_0603X30]
R?#1  22R  [RES_C_0603X30]  (masked out: inside a compile mask, not in the netlist)
R?#2  22R  [RES_C_0603X30]  (masked out: inside a compile mask, not in the netlist)
R?#3  22R  [RES_C_0603X30]  (masked out: inside a compile mask, not in the netlist)
U29  SAMA7G54  [TFBGA-343_14x14 - 2.5mm]  (parts A,B,C,D,E of 8)

### Ports
MCP16502_INT_PD9 (in), NRST (out), PAC1934_INT_PC8 (bidir)

### Nets
5V_SAMA7: R533.1
GND: C299.1 C300.1 J25.3 R391.1 R461.1 R536.2 R537.2 R538.2 R551.1
VDD_3V3: J25.2 R390.2 R460.2 R534.2 R535.2 R550.2
_PA0: R355.2 U29.H17(PA0)
_PA1: R357.2 U29.G20(PA1)
_PA2: R360.2 U29.L13(PA2)
_PA3: R363.2 U29.L14(PA3)
_PA4: R365.2 U29.K13(PA4)
_PA5: R368.2 U29.C21(PA5)
_PA6: R371.2 U29.K14(PA6)
_PA7: R373.2 U29.H16(PA7)
_PA8: R375.2 U29.B21(PA8)
_PA9: R377.2 U29.D20(PA9)
_PA10: R379.2 U29.J15(PA10)
_PA11: R381.2 U29.F20(PA11)
_PA17: R387.2 U29.V16(PA17)
_PA18: R388.2 U29.Y16(PA18)
_PA20: R389.2 U29.Y21(PA20)
_PA22: R392.2 U29.Y18(PA22)
_PA26: R395.2 U29.W16(PA26)
_PA27: R456.2 U29.W18(PA27)
_PA28: R457.2 U29.T14(PA28)
_PA29: R458.2 U29.W19(PA29)
_PA31: R486.2 U29.W20(PA31)
_PB0: R356.2 U29.U18(PB0)
_PB1: R358.2 U29.W21(PB1)
_PB2: R361.2 U29.T21(PB2)
_PB4: R366.2 U29.T20(PB4)
_PB5: R369.2 U29.V18(PB5)
_PB6: R372.2 U29.T19(PB6)
_PB7: R374.2 U29.V17(PB7)
_PB8: R376.2 U29.T18(PB8)
_PB9: R378.2 U29.P17(PB9)
_PB10: R380.2 U29.P15(PB10)
_PB11: R382.2 U29.G21(PB11)
_PB12: R383.2 U29.M15(PB12)
_PB13: R384.2 U29.R16(PB13)
_PB14: R385.2 U29.N14(PB14)
_PB15: R386.2 U29.N15(PB15)
_PB28: R550.1 R551.2 U29.G10(PB28)
_PB29: R459.2 U29.H11(PB29)
_PB30: R485.2 U29.B9(PB30)
_PB31: R487.2 U29.A13(PB31)
_PC0: R510.2 U29.A9(PC0)
_PC1: R511.2 U29.H10(PC1)
_PC2: R512.2 U29.A7(PC2)
_PC3: R390.1 R391.2 U29.G1(PC3)
_PC4: R513.2 U29.H5(PC4)
_PC5: R460.1 R461.2 U29.F2(PC5)
_PC7: R452.2 U29.J8(PC7)
_PC8: R454.2 U29.F1(PC8)
_PC9: R514.2 U29.G2(PC9)
_PC10: R515.2 U29.M10(PC10)
_PC11: R516.2 U29.K9(PC11)
_PC12: R518.2 U29.D1(PC12)
_PC13: R520.2 U29.F8(PC13)
_PC14: R522.2 U29.D6(PC14)
_PC15: R524.2 U29.H9(PC15)
_PC16: R526.2 U29.D5(PC16)
_PD00: R308.2 U29.G3(PD0)
_PD01: R309.2 U29.F4(PD1)
_PD12: R517.2 U29.P12(PD12)
_PD13: R519.2 U29.H18(PD13)
_PD14: R521.2 U29.C19(PD14)
_PD15: R523.2 U29.R12(PD15)
_PD16: R525.2 U29.D18(PD16)
_PD17: R527.2 U29.G18(PD17)
_PD18: R528.2 U29.B19(PD18)
_PD19: R529.2 U29.N11(PD19)
_PD28: R530.2 U29.J12(PD28)
_PD30: R531.2 U29.H13(PD30)
_PD31: R532.2 U29.C16(PD31)
_PE2: R359.2 U29.A18(PE2)
_PE3: R362.2 U29.C15(PE3)
_PE4: R364.2 U29.D15(PE4)
_PE5: R367.2 U29.B16(PE5)
_PE6: R370.2 U29.G13(PE6)
MCP16502_HPM: R386.1 R533.2 R536.1 ; off-sheet MCP16502_HPM
MCU_SOM_GPIO_A: R392.1 ; off-sheet MCU_SOM_GPIO_A
MCU_SOM_GPIO_B: R388.1 ; off-sheet MCU_SOM_GPIO_B
MCU_UART0_RX_SOM_TX: R528.1 ; off-sheet MCU_UART0_RX_SOM_TX
MCU_UART0_TX_SOM_RX: R529.1 ; off-sheet MCU_UART0_TX_SOM_RX
NTRST_PC25: C299.2 J25.6 R534.1 U29.B1(PC25)
SAM7_FLEX1_I2C_SCL: R515.1 ; off-sheet SAM7_FLEX1_I2C_SCL
SAM7_FLEX1_I2C_SDA: R514.1 ; off-sheet SAM7_FLEX1_I2C_SDA
SD2_CLK: R485.1 ; off-sheet SD2_CLK
SD2_CMD: R459.1 ; off-sheet SD2_CMD
SD2_DATA0: R487.1 ; off-sheet SD2_DATA0
SD2_DATA1: R510.1 ; off-sheet SD2_DATA1
SD2_DATA2: R511.1 ; off-sheet SD2_DATA2
SD2_DATA3: R512.1 ; off-sheet SD2_DATA3
SD2_nCD: R513.1 ; off-sheet SD2_nCD
SOM_CAM_I2C_SCL: R520.1 ; off-sheet SOM_CAM_I2C_SCL
SOM_CAM_I2C_SDA: R522.1 ; off-sheet SOM_CAM_I2C_SDA
SOM_CANRX0: R519.1 ; off-sheet SOM_CANRX0
SOM_CANRX1: R523.1 ; off-sheet SOM_CANRX1
SOM_CANTX0: R517.1 ; off-sheet SOM_CANTX0
SOM_CANTX1: R521.1 ; off-sheet SOM_CANTX1
SOM_CONSOLE_RX: R518.1 ; off-sheet SOM_CONSOLE_RX
SOM_CONSOLE_TX: R516.1 ; off-sheet SOM_CONSOLE_TX
SOM_EMMC_nRST: R360.1 ; off-sheet SOM_EMMC_nRST
SOM_I2C1_SCL: R454.1 ; off-sheet SOM_I2C1_SCL  [project net OBC_VS_SOM_I2C_SCL]
SOM_I2C1_SDA: R452.1 ; off-sheet SOM_I2C1_SDA  [project net OBC_VS_SOM_I2C_SDA]
SOM_MRAM_QSPI_CLK: R385.1 ; off-sheet SOM_MRAM_QSPI_CLK
SOM_MRAM_QSPI_IO0: R383.1 ; off-sheet SOM_MRAM_QSPI_IO0
SOM_MRAM_QSPI_IO1: R382.1 ; off-sheet SOM_MRAM_QSPI_IO1
SOM_MRAM_QSPI_IO2: R380.1 ; off-sheet SOM_MRAM_QSPI_IO2
SOM_MRAM_QSPI_IO3: R378.1 ; off-sheet SOM_MRAM_QSPI_IO3
SOM_PHOTO_ADC_CONV: R387.1 ; off-sheet SOM_PHOTO_ADC_CONV
SOM_PHOTO_ADC_EOC: R524.1 ; off-sheet SOM_PHOTO_ADC_EOC
SOM_PHOTO_ADC_nCS: R370.1 ; off-sheet SOM_PHOTO_ADC_nCS
SOM_PHOTO_SPI_MISO: R364.1 ; off-sheet SOM_PHOTO_SPI_MISO
SOM_PHOTO_SPI_MOSI: R362.1 ; off-sheet SOM_PHOTO_SPI_MOSI
SOM_PHOTO_SPI_SCK: R367.1 ; off-sheet SOM_PHOTO_SPI_SCK
SOM_PHOTO_SW_nCS: R359.1 ; off-sheet SOM_PHOTO_SW_nCS
SOM_PRAM_nCS: R456.1 ; off-sheet SOM_PRAM_nCS
SOM_PRAM_SPI_MISO: R458.1 ; off-sheet SOM_PRAM_SPI_MISO
SOM_PRAM_SPI_MOSI: R457.1 ; off-sheet SOM_PRAM_SPI_MOSI
SOM_PRAM_SPI_SCK: R395.1 ; off-sheet SOM_PRAM_SPI_SCK
SOM_RAM_QSPI_nCS: R384.1 ; off-sheet SOM_RAM_QSPI_nCS
SOM_RS422_DE: R309.1 ; off-sheet SOM_RS422_DE  [project net RS422_DE]
SOM_RS422_~{RE}: R308.1 ; off-sheet SOM_RS422_~{RE}  [project net RS422_~{RE}]
SOM_RS422_RX: R527.1 ; off-sheet SOM_RS422_RX
SOM_RS422_TX: R525.1 ; off-sheet SOM_RS422_TX
SOM_SDMMC0_OUT_CK: R355.1 ; off-sheet SOM_SDMMC0_OUT_CK
SOM_SDMMC0_OUT_CMD: R357.1 ; off-sheet SOM_SDMMC0_OUT_CMD
SOM_SDMMC0_OUT_D0: R363.1 ; off-sheet SOM_SDMMC0_OUT_D0
SOM_SDMMC0_OUT_D1: R365.1 ; off-sheet SOM_SDMMC0_OUT_D1
SOM_SDMMC0_OUT_D2: R368.1 ; off-sheet SOM_SDMMC0_OUT_D2
SOM_SDMMC0_OUT_D3: R371.1 ; off-sheet SOM_SDMMC0_OUT_D3
SOM_SDMMC0_OUT_D4: R373.1 ; off-sheet SOM_SDMMC0_OUT_D4
SOM_SDMMC0_OUT_D5: R375.1 ; off-sheet SOM_SDMMC0_OUT_D5
SOM_SDMMC0_OUT_D6: R377.1 ; off-sheet SOM_SDMMC0_OUT_D6
SOM_SDMMC0_OUT_D7: R379.1 ; off-sheet SOM_SDMMC0_OUT_D7
SOM_SDMMC0_OUT_DS: R381.1 ; off-sheet SOM_SDMMC0_OUT_DS
SOM_SPI6_MISO: R358.1 ; off-sheet SOM_SPI6_MISO  [project net OBC_VS_SOM_SPI_SG_MISO]
SOM_SPI6_MOSI: R361.1 ; off-sheet SOM_SPI6_MOSI  [project net OBC_VS_SOM_SPI_SG_MOSI]
SOM_SPI6_nCS0: R356.1 ; off-sheet SOM_SPI6_nCS0  [project net OBC_VS_SOM_SPI_SG_CS]
SOM_SPI6_SPCK: R486.1 ; off-sheet SOM_SPI6_SPCK  [project net OBC_VS_SOM_SPI_SG_SCK]
SOM_STATUS_LED_1: D37.2(A) R531.1 ; off-sheet SOM_STATUS_LED_1
SOM_STATUS_LED_2: D38.2(A) R532.1 ; off-sheet SOM_STATUS_LED_2
SOM_USB_LED_1: R389.1 ; off-sheet SOM_USB_LED_1
SOM_USB_LED_2: R530.1 ; off-sheet SOM_USB_LED_2
SOM_USB_PWR_EN1: R374.1 ; off-sheet SOM_USB_PWR_EN1
SOM_USB_PWR_EN2: R376.1 ; off-sheet SOM_USB_PWR_EN2
SOM_USB_SW_nOE: R366.1 ; off-sheet SOM_USB_SW_nOE
SOM_USB_SW_SEL0: R369.1 ; off-sheet SOM_USB_SW_SEL0
SOM_USB_SW_SEL1: R372.1 ; off-sheet SOM_USB_SW_SEL1
TCK_SWCLK_PC26: J25.5 U29.H7(PC26)
TDI_PC28: J25.4 U29.H6(PC28)
TDO_PC29: J25.7 U29.A2(PC29)
TMS_SWDIO_PC27: J25.8 U29.C1(PC27)
NetC300_2: C300.2 R535.1 ; port NRST
NetD37_1: D37.1(K) R537.1
NetD38_1: D38.1(K) R538.1
NetR337_2: R526.1 ; port PAC1934_INT_PC8
NetR342_1: U29.D19(PD9) ; port MCP16502_INT_PD9

Not connected (* = marked no-connect by the designer): J25 1; U29 A15(PD4) A16(PD5) A19(PD22)* A20(PD11) AA16(PA13) AA18(PIOBU2)* AA19(PIOBU0)* AA20(PA14) B13(PD8) B15(PD3) B18(PD29) C2(PC24) C3(PC22) C4(PC18) C18(PD20) C20(PB26) D2(PC31) D3(PC17) D4(PC20) D16(PD27) D17(PD24) D21(PB18) E4(PC21) E14(PE7) E18(PE0) F3(PC23) F14(PE1) F18(PD21) F19(PB23) F21(PB17) G4(PC30) G8(PC19) G12(PD6) G14(PD26) G16(PB27) G19(PB24) H12(PD2) H15(PB22) J11(PD7) J14(PB25) J20(PB21) J21(PB20) K8(PC6) K10(PD25)* K12(PD23)* M12(PD10) M13(PB19) M14(PB16) P9(PIOBU1)* P10(PIOBU3)* R13(PA23) R14(PA30)* U14(PA25) V14(PA12) V15(PA15) V19(PB3) V20(PA19) V21(PA21) Y15(PA16) Y19(PA24)

### Notes on the sheet
- SAMA7G5 Bus Distribution
- FLEXCOM6_MISO
- FLEXCOM6_nCS0
- FLEXCOM6_MOSI
- FLEXCOM0 MISO
- FLEXCOM0_nCS0
- FLEXCOM0 SPCK
- FLEXCOM0 MOSI
- TIOA1
- TIOA2
- FLEXCOM5_SPCK
- FLEXCOM6_SPCK
- FLEXCOM6_nCS1
- FLEXCOM5_NPCS0
- FLEXCOM5_MOSI
- FLEXCOM5_MISO
- SDMMC1 Reset Signal
- SDMMC1 Command Line
- SDMMC1 Data 0 Line
- SDMMC1 Clock Line
- SDMMC1 Data 1 Line
- SDMMC1 Data 2 Line
- SDMMC1 Data 3 Line
- SDMMC1 Write Protect Signal
- SDMMC1 Card Detect
- SDMMC1 1.8V/3.3V Selection
- FLEXCOM1 TWD/SDA
- FLEXCOM1 TWCK/SCL
- FLEXCOM7_TWD/SDA
- FLEXCOM7_TWCK/SCL
- AD2
- FLEXCOM8_SCL
- FLEXCOM8_SDA
- FLEXCOM2_TXD
- FLEXCOM2_RXD
- FLEXCOM3_TX
- CAN0_TX
- CAN0_RX
- CAN1_TX
- CAN1_RX
- SPI:3
- F0: PE3456
- F5: PA26-789
- FLEXCOM3_RX
- FLEXCOM4_TX
- FLEXCOM4_RX
- UART:3
- F4:PD18 PD19
- F6
- F3:PD16 PD17
- F2:PC11 12
- I2C:2
- F1:PC9 10
- F8:PC1314
- F7:PC7 8
- Project:
- BEE-1012
- Sub-system:
- SATELLITE_EXP_CONTROLLER
- Design by:
- SANG HUYNH
- BAO BUI
- Sheet title:
- Sheet
- A3
- of
- Checked by:
- Approved by:
- VU PHAM
- Revision:
- Document No:
- Size:
- Date:

### Library data of the parts
C299 C300 = _CAP_C_2: CAP
R308 R309 R355-R392 R395 R452 R454 R456-R461 R485-R487 R510-R538 R550 R551 R?#1-R?#3 = _RES_B_2: RES
U29 = SAMA7G54: SAMA7G54 MPU 1000MHz Cortex-A7 TFBGA-343; Manufacturer Part Number 1: SAMA7G54-V/4HB; Manufacturer 1: Microchip; Description_: MCHP MPU 32-BIT Cortex-A7 1000MHz 128kB SAMA7G54-V/4HB TFBGA-343; Populated: YES; MCHP-ID: MIC8923; Symbol: SAMA7G54 TFBGA-343; Dev Tools Status: Design; Owner: Ciprian Abramov; Package: TFBGA-343; Value: SAMA7G54; Type: 32-Bit MPU; Status: MCL Design; Revision: 1; Category: MCHP-Microcontroller; ComponentLink1Description: SVN Datasheet; ComponentLink2Description: Local Datasheet; ComponentLink3URL: C:\ALTIUM_WORK\00001_MCHP-CDB\Library\LibraryRefs\SAMA7G54 TFBGA-343.SchLib; ComponentLink3Description: Open Symbol; ComponentLink4URL: C:\ALTIUM_WORK\00001_MCHP-CDB\Library\Footprints\TFBGA-343_14x14.PcbLib; ComponentLink4Description: Open Footprint; ComponentLink5Description: Open Footprint 2; ComponentLink6Description: Open Footprint 3; ComponentLink7Description: Open Footprint 4; Supplier 1: Microchip; Supplier Part Number 1: SAMA7G54-V/4HB; Quantity Override: 1

## Sheet 08_SAMA7G54-DDR3.SchDoc
size 420 x 297 mm; SheetNumber: 16; SheetTotal: 33
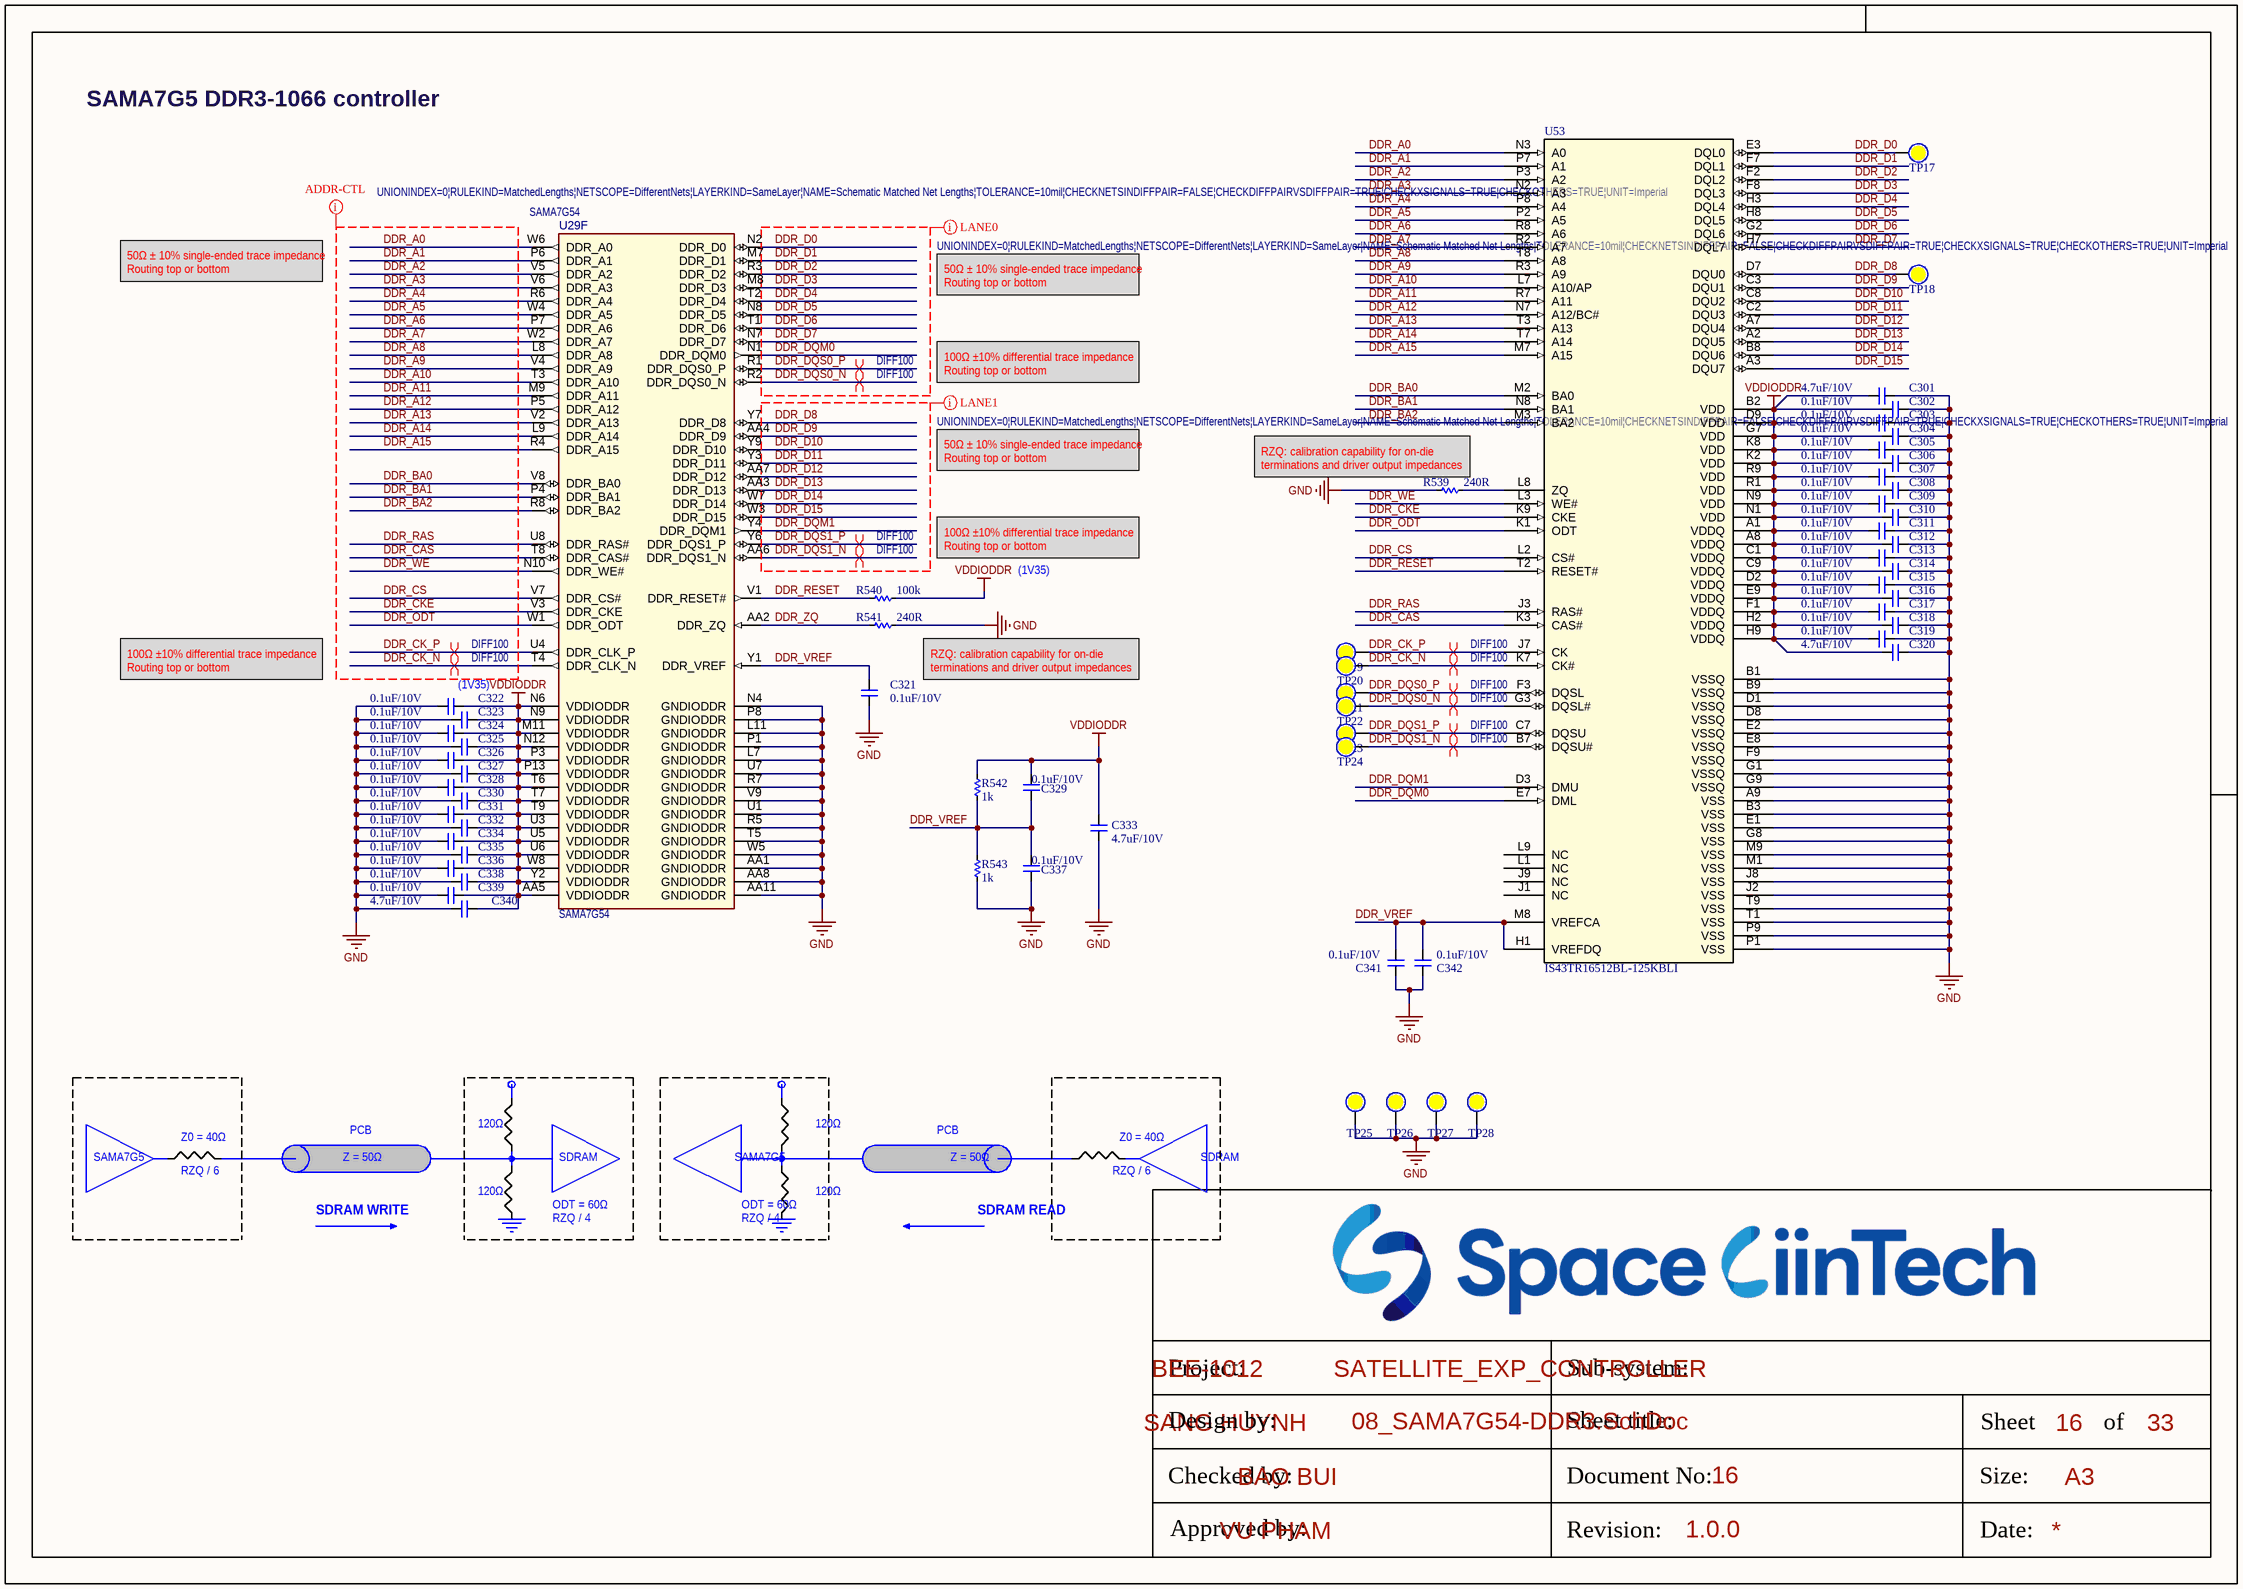
[diagram p17: 08_SAMA7G54-DDR3.SchDoc]

### Parts
C301  4.7uF/10V  [CAP_C_1005X50_L]
C302  0.1uF/10V  [CAP_C_0603x30]
C303  0.1uF/10V  [CAP_C_0603x30]
C304  0.1uF/10V  [CAP_C_0603x30]
C305  0.1uF/10V  [CAP_C_0603x30]
C306  0.1uF/10V  [CAP_C_0603x30]
C307  0.1uF/10V  [CAP_C_0603x30]
C308  0.1uF/10V  [CAP_C_0603x30]
C309  0.1uF/10V  [CAP_C_0603x30]
C310  0.1uF/10V  [CAP_C_0603x30]
C311  0.1uF/10V  [CAP_C_0603x30]
C312  0.1uF/10V  [CAP_C_0603x30]
C313  0.1uF/10V  [CAP_C_0603x30]
C314  0.1uF/10V  [CAP_C_0603x30]
C315  0.1uF/10V  [CAP_C_0603x30]
C316  0.1uF/10V  [CAP_C_0603x30]
C317  0.1uF/10V  [CAP_C_0603x30]
C318  0.1uF/10V  [CAP_C_0603x30]
C319  0.1uF/10V  [CAP_C_0603x30]
C320  4.7uF/10V  [CAP_C_1005X50_L]
C321  0.1uF/10V  [CAP_C_0603x30]
C322  0.1uF/10V  [CAP_C_0603x30]
C323  0.1uF/10V  [CAP_C_0603x30]
C324  0.1uF/10V  [CAP_C_0603x30]
C325  0.1uF/10V  [CAP_C_0603x30]
C326  0.1uF/10V  [CAP_C_0603x30]
C327  0.1uF/10V  [CAP_C_0603x30]
C328  0.1uF/10V  [CAP_C_0603x30]
C329  0.1uF/10V  [CAP_C_0603x30]
C330  0.1uF/10V  [CAP_C_0603x30]
C331  0.1uF/10V  [CAP_C_0603x30]
C332  0.1uF/10V  [CAP_C_0603x30]
C333  4.7uF/10V  [CAP_C_1005X50_L]
C334  0.1uF/10V  [CAP_C_0603x30]
C335  0.1uF/10V  [CAP_C_0603x30]
C336  0.1uF/10V  [CAP_C_0603x30]
C337  0.1uF/10V  [CAP_C_0603x30]
C338  0.1uF/10V  [CAP_C_0603x30]
C339  0.1uF/10V  [CAP_C_0603x30]
C340  4.7uF/10V  [CAP_C_1005X50_L]
C341  0.1uF/10V  [CAP_C_0603x30]
C342  0.1uF/10V  [CAP_C_0603x30]
R539  240R  [RES_C_0603X30]
R540  100k  [RES_C_0603X30]
R541  240R  [RES_C_0603X30]
R542  1k  [RES_C_0603X30]
R543  1k  [RES_C_0603X30]
TP17  (no value)  [TP_1mm_SMD]  (no BOM)
TP18  (no value)  [TP_1mm_SMD]  (no BOM)
TP19  (no value)  [TP_1mm_SMD]  (no BOM)
TP20  (no value)  [TP_1mm_SMD]  (no BOM)
TP21  (no value)  [TP_1mm_SMD]  (no BOM)
TP22  (no value)  [TP_1mm_SMD]  (no BOM)
TP23  (no value)  [TP_1mm_SMD]  (no BOM)
TP24  (no value)  [TP_1mm_SMD]  (no BOM)
TP25  (no value)  [TP_1mm_SMD]  (no BOM)
TP26  (no value)  [TP_1mm_SMD]  (no BOM)
TP27  (no value)  [TP_1mm_SMD]  (no BOM)
TP28  (no value)  [TP_1mm_SMD]  (no BOM)
U29  SAMA7G54  [TFBGA-343_14x14 - 2.5mm]  (part F of 8)
U53  IS43TR16512BL-125KBLI  [TWBGA96_ISI]

### Nets
GND: C301.1 C302.1 C303.1 C304.1 C305.1 C306.1 C307.1 C308.1 C309.1 C310.1 C311.1 C312.1 C313.1 C314.1 C315.1 C316.1 C317.1 C318.1 C319.1 C320.1 C321.2 C322.2 C323.2 C324.2 C325.2 C326.2 C327.2 C328.2 C330.2 C331.2 C332.2 C333.2 C334.2 C335.2 C336.2 C337.2 C338.2 C339.2 C340.2 C341.2 C342.2 R539.2 R541.1 R543.2 TP25.0 TP26.0 TP27.0 TP28.0 U29.AA1(GNDIODDR) U29.AA8(GNDIODDR) U29.AA11(GNDIODDR) U29.L7(GNDIODDR) U29.L11(GNDIODDR) U29.N4(GNDIODDR) U29.P1(GNDIODDR) U29.P8(GNDIODDR) U29.R5(GNDIODDR) U29.R7(GNDIODDR) U29.T5(GNDIODDR) U29.U1(GNDIODDR) U29.U7(GNDIODDR) U29.V9(GNDIODDR) U29.W5(GNDIODDR) U53.A9(VSS) U53.B1(VSSQ) U53.B3(VSS) U53.B9(VSSQ) U53.D1(VSSQ) U53.D8(VSSQ) U53.E1(VSS) U53.E2(VSSQ) U53.E8(VSSQ) U53.F9(VSSQ) U53.G1(VSSQ) U53.G8(VSS) U53.G9(VSSQ) U53.J2(VSS) U53.J8(VSS) U53.M1(VSS) U53.M9(VSS) U53.P1(VSS) U53.P9(VSS) U53.T1(VSS) U53.T9(VSS)
VDDIODDR: C301.2 C302.2 C303.2 C304.2 C305.2 C306.2 C307.2 C308.2 C309.2 C310.2 C311.2 C312.2 C313.2 C314.2 C315.2 C316.2 C317.2 C318.2 C319.2 C320.2 C322.1 C323.1 C324.1 C325.1 C326.1 C327.1 C328.1 C329.1 C330.1 C331.1 C332.1 C333.1 C334.1 C335.1 C336.1 C338.1 C339.1 C340.1 R540.1 R542.1 U29.AA5(VDDIODDR) U29.M11(VDDIODDR) U29.N6(VDDIODDR) U29.N9(VDDIODDR) U29.N12(VDDIODDR) U29.P3(VDDIODDR) U29.P13(VDDIODDR) U29.T6(VDDIODDR) U29.T7(VDDIODDR) U29.T9(VDDIODDR) U29.U3(VDDIODDR) U29.U5(VDDIODDR) U29.U6(VDDIODDR) U29.W8(VDDIODDR) U29.Y2(VDDIODDR) U53.A1(VDDQ) U53.A8(VDDQ) U53.B2(VDD) U53.C1(VDDQ) U53.C9(VDDQ) U53.D2(VDDQ) U53.D9(VDD) U53.E9(VDDQ) U53.F1(VDDQ) U53.G7(VDD) U53.H2(VDDQ) U53.H9(VDDQ) U53.K2(VDD) U53.K8(VDD) U53.N1(VDD) U53.N9(VDD) U53.R1(VDD) U53.R9(VDD)
DDR_A0: U29.W6(DDR_A0) U53.N3(A0)
DDR_A1: U29.P6(DDR_A1) U53.P7(A1)
DDR_A2: U29.V5(DDR_A2) U53.P3(A2)
DDR_A3: U29.V6(DDR_A3) U53.N2(A3)
DDR_A4: U29.R6(DDR_A4) U53.P8(A4)
DDR_A5: U29.W4(DDR_A5) U53.P2(A5)
DDR_A6: U29.P7(DDR_A6) U53.R8(A6)
DDR_A7: U29.W2(DDR_A7) U53.R2(A7)
DDR_A8: U29.L8(DDR_A8) U53.T8(A8)
DDR_A9: U29.V4(DDR_A9) U53.R3(A9)
DDR_A10: U29.T3(DDR_A10) U53.L7(A10/AP)
DDR_A11: U29.M9(DDR_A11) U53.R7(A11)
DDR_A12: U29.P5(DDR_A12) U53.N7(A12/BC#)
DDR_A13: U29.V2(DDR_A13) U53.T3(A13)
DDR_A14: U29.L9(DDR_A14) U53.T7(A14)
DDR_A15: U29.R4(DDR_A15) U53.M7(A15)
DDR_BA0: U29.V8(DDR_BA0) U53.M2(BA0)
DDR_BA1: U29.P4(DDR_BA1) U53.N8(BA1)
DDR_BA2: U29.R8(DDR_BA2) U53.M3(BA2)
DDR_CAS: U29.T8(DDR_CAS#) U53.K3(CAS#)
DDR_CK_N: TP20.0 U29.T4(DDR_CLK_N) U53.K7(CK#)
DDR_CK_P: TP19.0 U29.U4(DDR_CLK_P) U53.J7(CK)
DDR_CKE: U29.V3(DDR_CKE) U53.K9(CKE)
DDR_CS: U29.V7(DDR_CS#) U53.L2(CS#)
DDR_D0: TP17.0 U29.N2(DDR_D0) U53.E3(DQL0)
DDR_D1: U29.M7(DDR_D1) U53.F7(DQL1)
DDR_D2: U29.R3(DDR_D2) U53.F2(DQL2)
DDR_D3: U29.M8(DDR_D3) U53.F8(DQL3)
DDR_D4: U29.T2(DDR_D4) U53.H3(DQL4)
DDR_D5: U29.N8(DDR_D5) U53.H8(DQL5)
DDR_D6: U29.T1(DDR_D6) U53.G2(DQL6)
DDR_D7: U29.N7(DDR_D7) U53.H7(DQL7)
DDR_D8: TP18.0 U29.Y7(DDR_D8) U53.D7(DQU0)
DDR_D9: U29.AA4(DDR_D9) U53.C3(DQU1)
DDR_D10: U29.Y9(DDR_D10) U53.C8(DQU2)
DDR_D11: U29.Y3(DDR_D11) U53.C2(DQU3)
DDR_D12: U29.AA7(DDR_D12) U53.A7(DQU4)
DDR_D13: U29.AA3(DDR_D13) U53.A2(DQU5)
DDR_D14: U29.W7(DDR_D14) U53.B8(DQU6)
DDR_D15: U29.W3(DDR_D15) U53.A3(DQU7)
DDR_DQM0: U29.N1(DDR_DQM0) U53.E7(DML)
DDR_DQM1: U29.Y4(DDR_DQM1) U53.D3(DMU)
DDR_DQS0_N: TP22.0 U29.R2(DDR_DQS0_N) U53.G3(DQSL#)
DDR_DQS0_P: TP21.0 U29.R1(DDR_DQS0_P) U53.F3(DQSL)
DDR_DQS1_N: TP24.0 U29.AA6(DDR_DQS1_N) U53.B7(DQSU#)
DDR_DQS1_P: TP23.0 U29.Y6(DDR_DQS1_P) U53.C7(DQSU)
DDR_ODT: U29.W1(DDR_ODT) U53.K1(ODT)
DDR_RAS: U29.U8(DDR_RAS#) U53.J3(RAS#)
DDR_RESET: R540.2 U29.V1(DDR_RESET#) U53.T2(RESET#)
DDR_VREF: C321.1 C329.2 C337.1 C341.1 C342.1 R542.2 R543.1 U29.Y1(DDR_VREF) U53.H1(VREFDQ) U53.M8(VREFCA)
DDR_WE: U29.N10(DDR_WE#) U53.L3(WE#)
DDR_ZQ: R541.2 U29.AA2(DDR_ZQ)
NetR539_1: R539.1 U53.L8(ZQ)

Not connected (* = marked no-connect by the designer): U53 J1(NC) J9(NC) L1(NC) L9(NC)

### Layout directives
net class DDR-LANE0; rule Matched Net Lengths [Tolerance = 10mil]: DDR_D0, DDR_D1, DDR_D2, DDR_D3, DDR_D4, DDR_D5, DDR_D6, DDR_D7, DDR_DQM0, DDR_DQS0_N, DDR_DQS0_P
net class DDR-LANE1; rule Matched Net Lengths [Tolerance = 10mil]: DDR_D8, DDR_D9, DDR_D10, DDR_D11, DDR_D12, DDR_D13, DDR_D14, DDR_D15, DDR_DQM1, DDR_DQS1_N, DDR_DQS1_P
net class DDR-ADDR-CTL; rule Matched Net Lengths [Tolerance = 10mil]: DDR_A0, DDR_A1, DDR_A2, DDR_A3, DDR_A4, DDR_A5, DDR_A6, DDR_A7, DDR_A8, DDR_A9, DDR_A10, DDR_A11, DDR_A12, DDR_A13, DDR_A14, DDR_A15, DDR_BA0, DDR_BA1, DDR_BA2, DDR_CAS, DDR_CK_N, DDR_CK_P, DDR_CKE, DDR_CS, DDR_ODT, DDR_RAS, DDR_WE
differential pair; differential pair class DIFF100; net class DIFF100; rule Matched Net Lengths [Tolerance = 4mil]: DDR_CK_N, DDR_CK_P, DDR_DQS0_N, DDR_DQS0_P, DDR_DQS1_N, DDR_DQS1_P

### Notes on the sheet
- SAMA7G5 DDR3-1066 controller
- 50Ω ± 10% single-ended trace impedance
  Routing top or bottom
- 100Ω ±10% differential trace impedance
  Routing top or bottom
- (near R539) RZQ: calibration capability for on-die terminations and driver output impedances
- (1V35)
- (near C322) (1V35)
- RZQ: calibration capability for on-die terminations and driver output impedances
- PCB
- 120Ω
- SAMA7G5
- Z0 = 40Ω
- RZQ / 6
- Z = 50Ω
- ODT = 60Ω
- SDRAM
- SDRAM WRITE
- RZQ / 4
- SDRAM READ
- Project:
- BEE-1012
- Sub-system:
- SATELLITE_EXP_CONTROLLER
- Design by:
- SANG HUYNH
- BAO BUI
- Sheet title:
- Sheet
- A3
- of
- Checked by:
- Approved by:
- VU PHAM
- Revision:
- Document No:
- Size:
- Date:

### Library data of the parts
C301-C342 = _CAP_C_2: CAP
R539-R543 = _RES_B_2: RES
TP17-TP28 = Test Point: Solder: NF
U29 = SAMA7G54: as U29 on sheet 08_SAMA7G54-PIO; Package: TFBGA-343; Value: SAMA7G54; Type: 32-Bit MPU; Status: MCL Design; Revision: 1; Category: MCHP-Microcontroller; ComponentLink1Description: SVN Datasheet; ComponentLink2Description: Local Datasheet; ComponentLink3URL: C:\ALTIUM_WORK\00001_MCHP-CDB\Library\LibraryRefs\SAMA7G54 TFBGA-343.SchLib; ComponentLink3Description: Open Symbol; ComponentLink4URL: C:\ALTIUM_WORK\00001_MCHP-CDB\Library\Footprints\TFBGA-343_14x14.PcbLib; ComponentLink4Description: Open Footprint; ComponentLink5Description: Open Footprint 2; ComponentLink6Description: Open Footprint 3; ComponentLink7Description: Open Footprint 4; Supplier 1: Microchip; Supplier Part Number 1: SAMA7G54-V/4HB; Quantity Override: 1
U53 = IC_RAM_IS43TR16512BL-125KBLI: DDR3L; Manufacturer_Name: ISSI; Copyright: Copyright (C) 2025 Ultra Librarian. All rights reserved.; Manufacturer_Part_Number: IS43TR16512BL-125KBLI; RefDes: RefDes; Type: Type

## Sheet 08_SOM_USB_CARD.SchDoc
size 420 x 297 mm; SheetNumber: 17; SheetTotal: 33
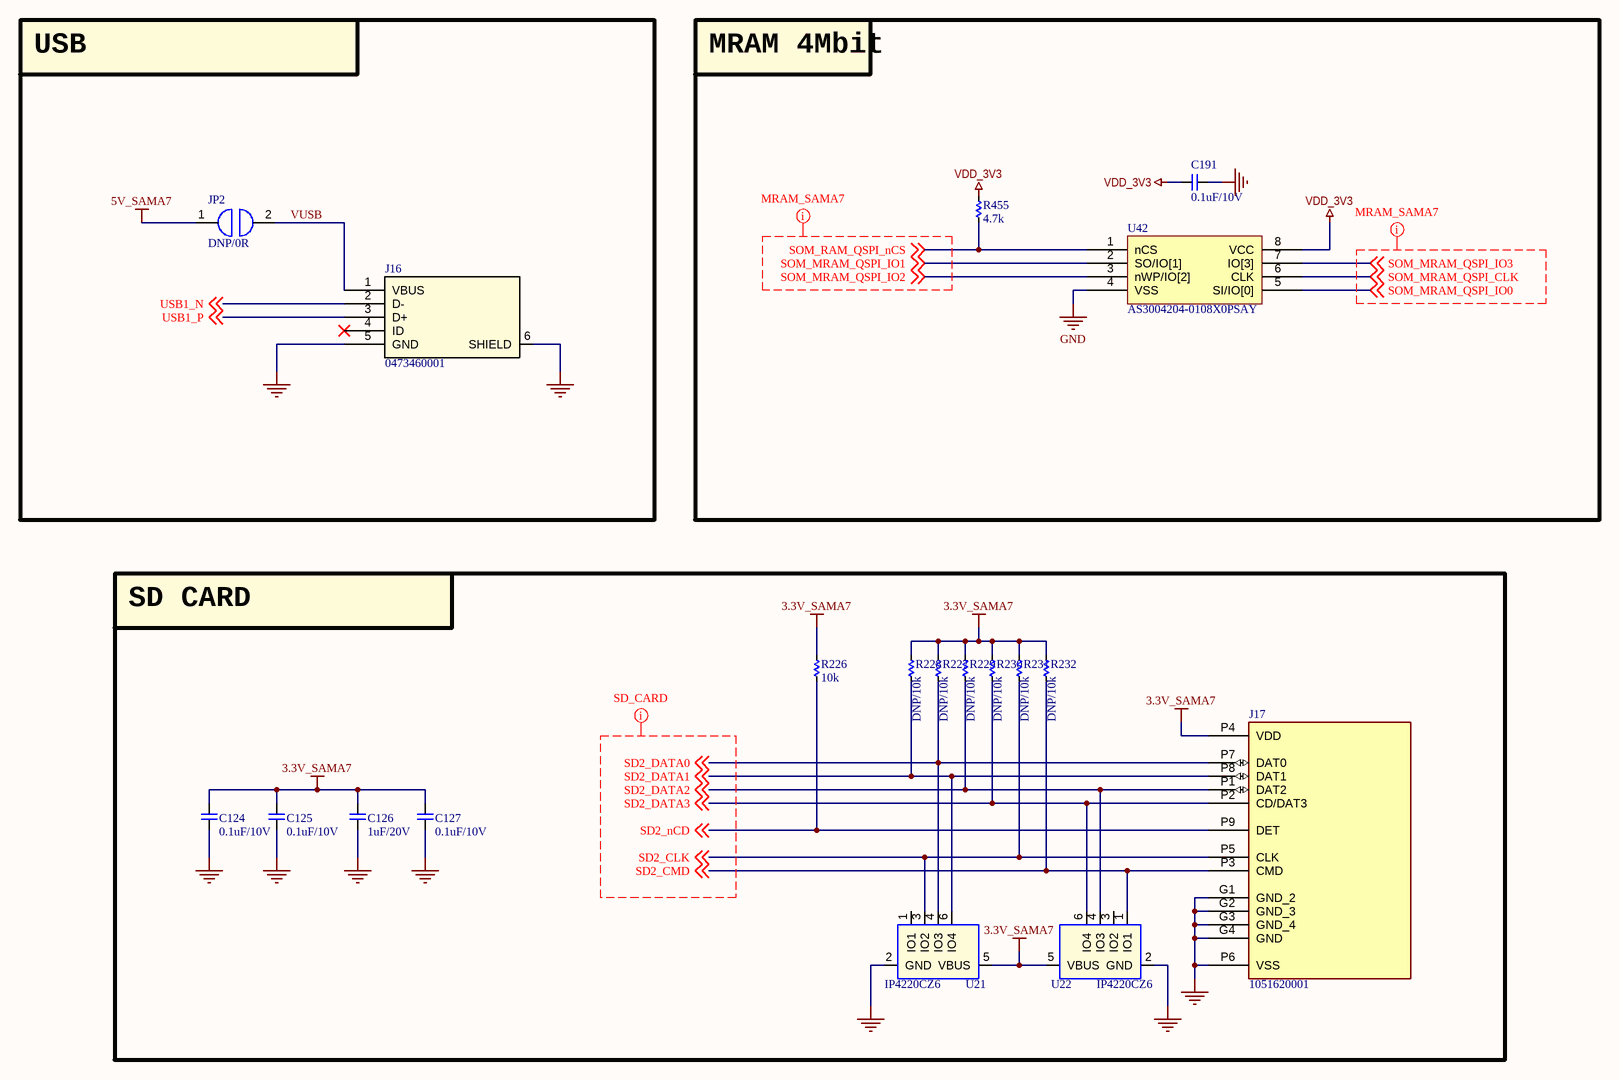
[diagram p18: 08_SOM_USB_CARD.SchDoc]

### Parts
(Parts that share a designator on the sheet are numbered #1, #2 ... from top to bottom, then left to right.)
C124  0.1uF/10V  [CAP_C_1005X50_L]
C125  0.1uF/10V  [CAP_C_1005X50_L]
C126  1uF/20V  [CAP_C_1005X50_L]
C127  0.1uF/10V  [CAP_C_1005X50_L]
C191  0.1uF/10V  [CAP_C_1005X50_L]
J16  0473460001  [47346-0001_MOL]
J17  1051620001  [Molex_1051620001]
JP2  DNP/0R  [JUMPER_1608]
R226  10k  [RES_C_1005x30_L]
R227  DNP/10k  [RES_C_1005x30_L]
R228  DNP/10k  [RES_C_1005x30_L]
R229  DNP/10k  [RES_C_1005x30_L]
R230  DNP/10k  [RES_C_1005x30_L]
R231  DNP/10k  [RES_C_1005x30_L]
R232  DNP/10k  [RES_C_1005x30_L]
R455  4.7k  [RES_C_1005x30_L]
U21  IP4220CZ6  [SOT95P280X145-6N]
U22#2  IP4220CZ6  [SOT95P280X145-6N]
U42  AS3004204-0108X0PSAY  [SOIC127P790X216-8]

### Blocks framed on the sheet
USB: J16 JP2
MRAM 4Mbit: C191 R455 U42
SD CARD: C124-C127 J17 R226-R232 U21 U22#2

### Nets
3.3V_SAMA7: C124.2 C125.2 C126.2 C127.2 J17.P4(VDD) R226.2 R227.2 R228.2 R229.2 R230.2 R231.2 R232.2 U21.5(VBUS) U22#2.5(VBUS)
5V_SAMA7: JP2.1
GND: C124.1 C125.1 C126.1 C127.1 C191.1 J16.5(GND) J16.6(SHIELD) J17.G1(GND_2) J17.G2(GND_3) J17.G3(GND_4) J17.G4(GND) J17.P6(VSS) U21.2(GND) U22#2.2(GND) U42.4(VSS)
VDD_3V3: C191.2 R455.2 U42.8(VCC)
SD2_CLK: J17.P5(CLK) R231.1 U21.3(IO2) ; off-sheet SD2_CLK
SD2_CMD: J17.P3(CMD) R232.1 U22#2.1(IO1) ; off-sheet SD2_CMD
SD2_DATA0: J17.P7(DAT0) R227.1 U21.4(IO3) ; off-sheet SD2_DATA0
SD2_DATA1: J17.P8(DAT1) R228.1 U21.6(IO4) ; off-sheet SD2_DATA1
SD2_DATA2: J17.P1(DAT2) R229.1 U22#2.4(IO3) ; off-sheet SD2_DATA2
SD2_DATA3: J17.P2(CD/DAT3) R230.1 U22#2.6(IO4) ; off-sheet SD2_DATA3
SD2_nCD: J17.P9(DET) R226.1 ; off-sheet SD2_nCD
SOM_MRAM_QSPI_CLK: U42.6(CLK) ; off-sheet SOM_MRAM_QSPI_CLK
SOM_MRAM_QSPI_IO0: U42.5(SI/IO[0]) ; off-sheet SOM_MRAM_QSPI_IO0
SOM_MRAM_QSPI_IO1: U42.2(SO/IO[1]) ; off-sheet SOM_MRAM_QSPI_IO1
SOM_MRAM_QSPI_IO2: U42.3(nWP/IO[2]) ; off-sheet SOM_MRAM_QSPI_IO2
SOM_MRAM_QSPI_IO3: U42.7(IO[3]) ; off-sheet SOM_MRAM_QSPI_IO3
SOM_RAM_QSPI_nCS: R455.1 U42.1(nCS) ; off-sheet SOM_RAM_QSPI_nCS
USB1_N: J16.2(D-) ; off-sheet USB1_N  [project net USBB_N]
USB1_P: J16.3(D+) ; off-sheet USB1_P  [project net USBB_P]
VUSB: J16.1(VBUS) JP2.2

Not connected (* = marked no-connect by the designer): J16 4(ID)*; U21 1(IO1); U22#2 3(IO2)

### Layout directives
net class MRAM_SAMA7: SOM_MRAM_QSPI_CLK, SOM_MRAM_QSPI_IO0, SOM_MRAM_QSPI_IO1, SOM_MRAM_QSPI_IO2, SOM_MRAM_QSPI_IO3, SOM_RAM_QSPI_nCS
net class SD_CARD: SD2_CLK, SD2_CMD, SD2_DATA0, SD2_DATA1, SD2_DATA2, SD2_DATA3, SD2_nCD

### Notes on the sheet
- Project:
- BEE-1012
- Sub-system:
- SATELLITE_EXP_CONTROLLER
- Design by:
- SANG HUYNH
- BAO BUI
- Sheet title:
- Sheet
- A3
- of
- Checked by:
- Approved by:
- VU PHAM
- Revision:
- Document No:
- Size:
- Date:

### Library data of the parts
C124-C127 C191 = _CAP_C_2: CAP
J16 = USB_micro: No Description Available; Mfr_Name: Molex Connector Corporation; RefDes: RefDes; Type: Type
J17 = Molex_1051620001: 9 (8 + 1) Position Card Connector Secure Digital - microSDâ„¢ Surface Mount, Right Angle Gold; MF: Molex; SnapEDA_Link: https://www.snapeda.com/parts/1051620001/Molex/view-part/?ref=snap; Package: None; Value: *; MP: 1051620001; Check_prices: https://www.snapeda.com/parts/1051620001/Molex/view-part/?ref=eda
JP2 = JUMPER
R226-R232 R455 = _RES_B_2: RES
U21 U22#2 = IP4220CZ6_0: P/N: 132D42200S; PCB Footprint: SOT23-6L; CLABCONF0: =SB-UCMIMX93
U42 = IC_RAM_AS3004204-0108X0PSAY